# EAGLE design MOD-v2-4 (EAGLE 8.3.1)
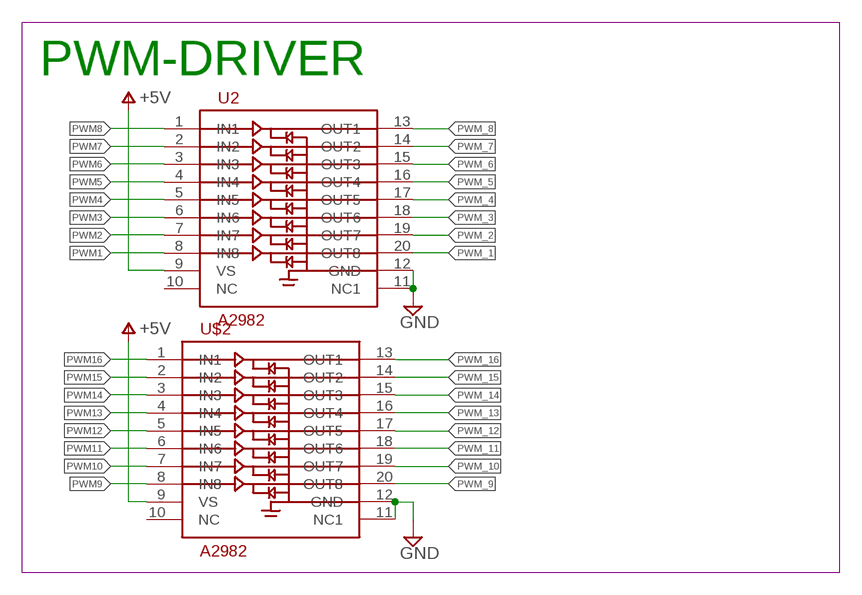
[diagram p0: schematic, sheet 1, part 1 of 2]
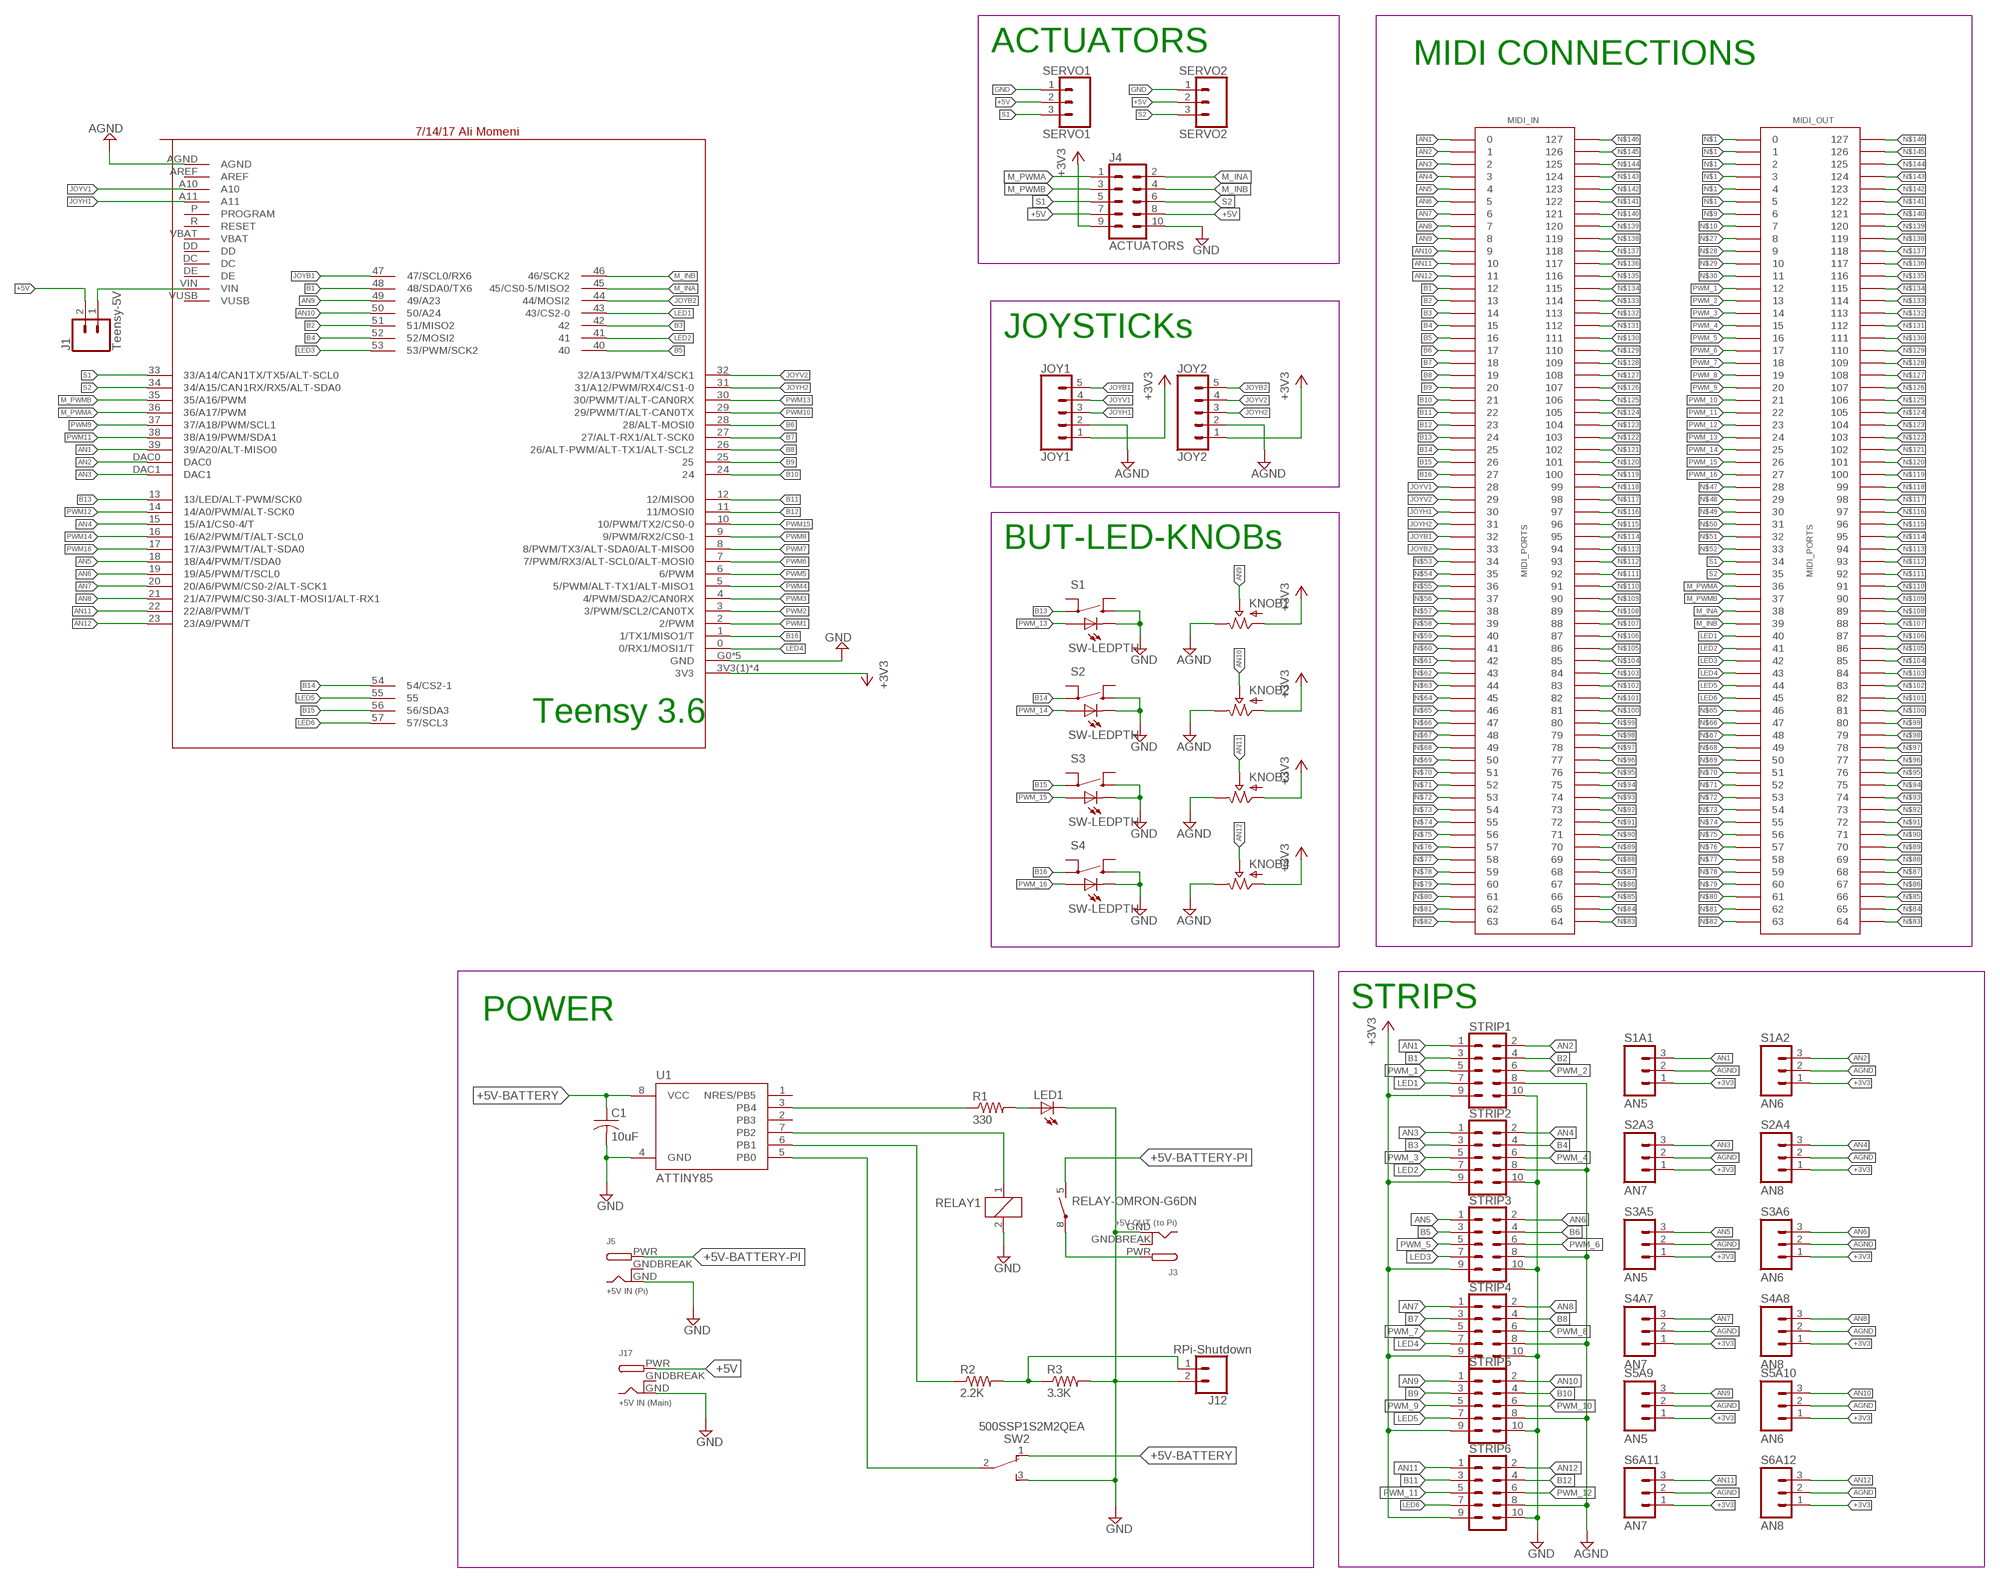
[diagram p1: schematic, sheet 1, part 2 of 2]

## Parts
C1  10uF  C-US050-024X044  [C050-024X044]
J1  Teensy-5V  CONN_02LOCK  [1X02_LOCK]
J3  +5V OUT (to Pi)  DCBARRELPTH  [DCJACK_2MM_PTH]
J4  ACTUATORS  CONN_05X2SHD_LOCK  [2X5-SHROUDED_LOCK]
J5  +5V IN (Pi)  DCBARRELPTH  [DCJACK_2MM_PTH]
J12  RPi-Shutdown  CONN_02LOCK  [1X02_LOCK]
J17  +5V IN (Main)  DCBARRELPTH  [DCJACK_2MM_PTH]
JOY1  JOY1  CONN_05LOCK  [1X05_LOCK]
JOY2  JOY2  CONN_05LOCK  [1X05_LOCK]
KNOB1  POTALPHA_RD901  [POT_ALPHA_RD901F-40-(L)R1]
KNOB2  POTALPHA_RD901  [POT_ALPHA_RD901F-40-(L)R1]
KNOB3  POTALPHA_RD901  [POT_ALPHA_RD901F-40-(L)R1]
KNOB4  POTALPHA_RD901  [POT_ALPHA_RD901F-40-(L)R1]
LED1  LED3MM  [LED3MM]
MIDI_IN  MIDI_PORTS  (no package)
MIDI_OUT  MIDI_PORTS  (no package)
R1  330  R-US_0204/7  [0204/7]
R2  2.2K  R-US_0204/7  [0204/7]
R3  3.3K  R-US_0204/7  [0204/7]
RELAY1  RELAY-OMRON-G6DN  [G6DN-1A]
S1  SW-LEDPTH  [SWITCH_TR2-MOMENTARY-LED]
S1A1  AN5  M03LOCK  [1X03_LOCK]
S1A2  AN6  M03LOCK  [1X03_LOCK]
S2  SW-LEDPTH  [SWITCH_TR2-MOMENTARY-LED]
S2A3  AN7  M03LOCK  [1X03_LOCK]
S2A4  AN8  M03LOCK  [1X03_LOCK]
S3  SW-LEDPTH  [SWITCH_TR2-MOMENTARY-LED]
S3A5  AN5  M03LOCK  [1X03_LOCK]
S3A6  AN6  M03LOCK  [1X03_LOCK]
S4  SW-LEDPTH  [SWITCH_TR2-MOMENTARY-LED]
S4A7  AN7  M03LOCK  [1X03_LOCK]
S4A8  AN8  M03LOCK  [1X03_LOCK]
S5A9  AN5  M03LOCK  [1X03_LOCK]
S5A10  AN6  M03LOCK  [1X03_LOCK]
S6A11  AN7  M03LOCK  [1X03_LOCK]
S6A12  AN8  M03LOCK  [1X03_LOCK]
SERVO1  SERVO1  CONN_03LOCK  [1X03_LOCK@1]
SERVO2  SERVO2  CONN_03LOCK  [1X03_LOCK@1]
STRIP1  CONN_05X2SHD_LOCK  [2X5-SHROUDED_LOCK]
STRIP2  CONN_05X2SHD_LOCK  [2X5-SHROUDED_LOCK]
STRIP3  CONN_05X2SHD_LOCK  [2X5-SHROUDED_LOCK]
STRIP4  CONN_05X2SHD_LOCK  [2X5-SHROUDED_LOCK]
STRIP5  CONN_05X2SHD_LOCK  [2X5-SHROUDED_LOCK]
STRIP6  CONN_05X2SHD_LOCK  [2X5-SHROUDED_LOCK]
SW2  500SSP1S2M2QEA  SWITCH_SPDT500SSP1S2M2QEA  [SWITCH_SPDT_500SSP1S2M2QEA]
TEENSY  TEENSY3_6-ALI_NO-USB-HOST  [TEENSY3-6_NO-USB-HOST]
U1  ATTINY85  [DIL08]
U2  A2982  [SOIC20]
U$2  A2982  [SOIC20]

## Nets
+3V3: J4.9 JOY1.1 JOY2.1 KNOB1.1(IN) KNOB2.1(IN) KNOB3.1(IN) KNOB4.1(IN) S1A1.1 S1A2.1 S2A3.1 S2A4.1 S3A5.1 S3A6.1 S4A7.1 S4A8.1 S5A9.1 S5A10.1 S6A11.1 S6A12.1 STRIP1.9 STRIP2.9 STRIP3.9 STRIP4.9 STRIP5.9 STRIP6.9 TEENSY.3V3(1)(3V3) TEENSY.3V3(2)(3V3) TEENSY.3V3(3)(3V3) TEENSY.3V3(4)(3V3)
+5V [Power Source]: J1.2 J4.7 J4.8 J17.PWR R1.1 SERVO1.2 SERVO2.2 U1.3(PB4) U2.9(VS) U$2.9(VS) ; supply symbol labelled V+
+5V-BATTERY [Power Source]: C1.1 SW2.1 U1.8(VCC)
+5V-BATTERY-PI [Power Source]: J5.PWR RELAY1.5
AGND [Analog Sig]: JOY1.2 JOY2.2 KNOB1.3(OUT) KNOB2.3(OUT) KNOB3.3(OUT) KNOB4.3(OUT) S1A1.2 S1A2.2 S2A3.2 S2A4.2 S3A5.2 S3A6.2 S4A7.2 S4A8.2 S5A9.2 S5A10.2 S6A11.2 S6A12.2 STRIP1.8 STRIP2.8 STRIP3.8 STRIP4.8 STRIP5.8 STRIP6.8 TEENSY.AGND
AN1 [Analog Sig]: MIDI_IN.0 S1A1.3 STRIP1.1 TEENSY.39(39/A20/ALT-MISO0)
AN2 [Analog Sig]: MIDI_IN.1 S1A2.3 STRIP1.2 TEENSY.DAC0
AN3 [Analog Sig]: MIDI_IN.2 S2A3.3 STRIP2.1 TEENSY.DAC1
AN4 [Analog Sig]: MIDI_IN.3 S2A4.3 STRIP2.2 TEENSY.15(15/A1/CS0-4/T)
AN5 [Analog Sig]: MIDI_IN.4 S3A5.3 STRIP3.1 TEENSY.18(18/A4/PWM/T/SDA0)
AN6 [Analog Sig]: MIDI_IN.5 S3A6.3 STRIP3.2 TEENSY.19(19/A5/PWM/T/SCL0)
AN7 [Analog Sig]: MIDI_IN.6 S4A7.3 STRIP4.1 TEENSY.20(20/A6/PWM/CS0-2/ALT-SCK1)
AN8 [Analog Sig]: MIDI_IN.7 S4A8.3 STRIP4.2 TEENSY.21(21/A7/PWM/CS0-3/ALT-MOSI1/ALT-RX1)
AN9 [Analog Sig]: KNOB1.2(WIPER) MIDI_IN.8 S5A9.3 STRIP5.1 TEENSY.49(49/A23)
AN10 [Analog Sig]: KNOB2.2(WIPER) MIDI_IN.9 S5A10.3 STRIP5.2 TEENSY.50(50/A24)
AN11 [Analog Sig]: KNOB3.2(WIPER) MIDI_IN.10 S6A11.3 STRIP6.1 TEENSY.22(22/A8/PWM/T)
AN12 [Analog Sig]: KNOB4.2(WIPER) MIDI_IN.11 S6A12.3 STRIP6.2 TEENSY.23(23/A9/PWM/T)
B1: MIDI_IN.12 STRIP1.3 TEENSY.48(48/SDA0/TX6)
B2: MIDI_IN.13 STRIP1.4 TEENSY.51(51/MISO2)
B3: MIDI_IN.14 STRIP2.3 TEENSY.42
B4: MIDI_IN.15 STRIP2.4 TEENSY.52(52/MOSI2)
B5: MIDI_IN.16 STRIP3.3 TEENSY.40
B6: MIDI_IN.17 STRIP3.4 TEENSY.28(28/ALT-MOSI0)
B7: MIDI_IN.18 STRIP4.3 TEENSY.27(27/ALT-RX1/ALT-SCK0)
B8: MIDI_IN.19 STRIP4.4 TEENSY.26(26/ALT-PWM/ALT-TX1/ALT-SCL2)
B9: MIDI_IN.20 STRIP5.3 TEENSY.25
B10: MIDI_IN.21 STRIP5.4 TEENSY.24
B11: MIDI_IN.22 STRIP6.3 TEENSY.12(12/MISO0)
B12: MIDI_IN.23 STRIP6.4 TEENSY.11(11/MOSI0)
B13: MIDI_IN.24 S1.3 TEENSY.13(13/LED/ALT-PWM/SCK0)
B14: MIDI_IN.25 S2.3 TEENSY.54(54/CS2-1)
B15: MIDI_IN.26 S3.3 TEENSY.56(56/SDA3)
B16: MIDI_IN.27 S4.3 TEENSY.1(1/TX1/MISO1/T)
GND [Power]: C1.2 J3.GND J4.10 J5.GND J12.2 J17.GND LED1.K(C) R3.2 RELAY1.2 S1.1 S1.C S2.1 S2.C S3.1 S3.C S4.1 S4.C SERVO1.1 SERVO2.1 STRIP1.10 STRIP2.10 STRIP3.10 STRIP4.10 STRIP5.10 STRIP6.10 SW2.3 TEENSY.G0(GND) TEENSY.G1(GND) TEENSY.G2(GND) TEENSY.G3(GND) TEENSY.G6(GND) U1.4(GND) U2.11(NC1) U2.12(GND) U$2.11(NC1) U$2.12(GND)
JOYB1: JOY1.5 MIDI_IN.32 TEENSY.47(47/SCL0/RX6)
JOYB2: JOY2.5 MIDI_IN.33 TEENSY.44(44/MOSI2)
JOYH1 [Analog Sig]: JOY1.3 MIDI_IN.30 TEENSY.A11
JOYH2 [Analog Sig]: JOY2.3 MIDI_IN.31 TEENSY.31(31/A12/PWM/RX4/CS1-0)
JOYV1 [Analog Sig]: JOY1.4 MIDI_IN.28 TEENSY.A10
JOYV2 [Analog Sig]: JOY2.4 MIDI_IN.29 TEENSY.32(32/A13/PWM/TX4/SCK1)
LED1: MIDI_OUT.40 STRIP1.7 TEENSY.43(43/CS2-0)
LED2: MIDI_OUT.41 STRIP2.7 TEENSY.41
LED3: MIDI_OUT.42 STRIP3.7 TEENSY.53(53/PWM/SCK2)
LED4: MIDI_OUT.43 STRIP4.7 TEENSY.0(0/RX1/MOSI1/T)
LED5: MIDI_OUT.44 STRIP5.7 TEENSY.55
LED6: MIDI_OUT.45 STRIP6.7 TEENSY.57(57/SCL3)
M_INA: J4.2 MIDI_OUT.38 TEENSY.45(45/CS0-5/MISO2)
M_INB: J4.4 MIDI_OUT.39 TEENSY.46(46/SCK2)
M_PWMA: J4.1 MIDI_OUT.36 TEENSY.36(36/A17/PWM)
M_PWMB: J4.3 MIDI_OUT.37 TEENSY.35(35/A16/PWM)
N$1: MIDI_OUT.0 MIDI_OUT.1 MIDI_OUT.2 MIDI_OUT.3 MIDI_OUT.4 MIDI_OUT.5
N$2: LED1.A R1.2
N$3: SW2.2 U1.5(PB0)
N$4: RELAY1.1 U1.7(PB2)
N$5: J12.1 R2.2 R3.1
N$6 [Power Source]: J3.PWR RELAY1.8
N$7: J1.1 TEENSY.VIN
N$9: MIDI_OUT.6
N$10: MIDI_OUT.7
N$27: MIDI_OUT.8
N$28: MIDI_OUT.9
N$29: MIDI_OUT.10
N$30: MIDI_OUT.11
N$47: MIDI_OUT.28
N$48: MIDI_OUT.29
N$49: MIDI_OUT.30
N$50: MIDI_OUT.31
N$51: MIDI_OUT.32
N$52: MIDI_OUT.33
N$53: MIDI_IN.34
N$54: MIDI_IN.35
N$55: MIDI_IN.36
N$56: MIDI_IN.37
N$57: MIDI_IN.38
N$58: MIDI_IN.39
N$59: MIDI_IN.40
N$60: MIDI_IN.41
N$61: MIDI_IN.42
N$62: MIDI_IN.43
N$63: MIDI_IN.44
N$64: MIDI_IN.45
N$65: MIDI_IN.46 MIDI_OUT.46
N$66: MIDI_IN.47 MIDI_OUT.47
N$67: MIDI_IN.48 MIDI_OUT.48
N$68: MIDI_IN.49 MIDI_OUT.49
N$69: MIDI_IN.50 MIDI_OUT.50
N$70: MIDI_IN.51 MIDI_OUT.51
N$71: MIDI_IN.52 MIDI_OUT.52
N$72: MIDI_IN.53 MIDI_OUT.53
N$73: MIDI_IN.54 MIDI_OUT.54
N$74: MIDI_IN.55 MIDI_OUT.55
N$75: MIDI_IN.56 MIDI_OUT.56
N$76: MIDI_IN.57 MIDI_OUT.57
N$77: MIDI_IN.58 MIDI_OUT.58
N$78: MIDI_IN.59 MIDI_OUT.59
N$79: MIDI_IN.60 MIDI_OUT.60
N$80: MIDI_IN.61 MIDI_OUT.61
N$81: MIDI_IN.62 MIDI_OUT.62
N$82: MIDI_IN.63 MIDI_OUT.63
N$83: MIDI_IN.64 MIDI_OUT.64
N$84: MIDI_IN.65 MIDI_OUT.65
N$85: MIDI_IN.66 MIDI_OUT.66
N$86: MIDI_IN.67 MIDI_OUT.67
N$87: MIDI_IN.68 MIDI_OUT.68
N$88: MIDI_IN.69 MIDI_OUT.69
N$89: MIDI_IN.70 MIDI_OUT.70
N$90: MIDI_IN.71 MIDI_OUT.71
N$91: MIDI_IN.72 MIDI_OUT.72
N$92: MIDI_IN.73 MIDI_OUT.73
N$93: MIDI_IN.74 MIDI_OUT.74
N$94: MIDI_IN.75 MIDI_OUT.75
N$95: MIDI_IN.76 MIDI_OUT.76
N$96: MIDI_IN.77 MIDI_OUT.77
N$97: MIDI_IN.78 MIDI_OUT.78
N$98: MIDI_IN.79 MIDI_OUT.79
N$99: MIDI_IN.80 MIDI_OUT.80
N$100: MIDI_IN.81 MIDI_OUT.81
N$101: MIDI_IN.82 MIDI_OUT.82
N$102: MIDI_IN.83 MIDI_OUT.83
N$103: MIDI_IN.84 MIDI_OUT.84
N$104: MIDI_IN.85 MIDI_OUT.85
N$105: MIDI_IN.86 MIDI_OUT.86
N$106: MIDI_IN.87 MIDI_OUT.87
N$107: MIDI_IN.88 MIDI_OUT.88
N$108: MIDI_IN.89 MIDI_OUT.89
N$109: MIDI_IN.90 MIDI_OUT.90
N$110: MIDI_IN.91 MIDI_OUT.91
N$111: MIDI_IN.92 MIDI_OUT.92
N$112: MIDI_IN.93 MIDI_OUT.93
N$113: MIDI_IN.94 MIDI_OUT.94
N$114: MIDI_IN.95 MIDI_OUT.95
N$115: MIDI_IN.96 MIDI_OUT.96
N$116: MIDI_IN.97 MIDI_OUT.97
N$117: MIDI_IN.98 MIDI_OUT.98
N$118: MIDI_IN.99 MIDI_OUT.99
N$119: MIDI_IN.100 MIDI_OUT.100
N$120: MIDI_IN.101 MIDI_OUT.101
N$121: MIDI_IN.102 MIDI_OUT.102
N$122: MIDI_IN.103 MIDI_OUT.103
N$123: MIDI_IN.104 MIDI_OUT.104
N$124: MIDI_IN.105 MIDI_OUT.105
N$125: MIDI_IN.106 MIDI_OUT.106
N$126: MIDI_IN.107 MIDI_OUT.107
N$127: MIDI_IN.108 MIDI_OUT.108
N$128: MIDI_IN.109 MIDI_OUT.109
N$129: MIDI_IN.110 MIDI_OUT.110
N$130: MIDI_IN.111 MIDI_OUT.111
N$131: MIDI_IN.112 MIDI_OUT.112
N$132: MIDI_IN.113 MIDI_OUT.113
N$133: MIDI_IN.114 MIDI_OUT.114
N$134: MIDI_IN.115 MIDI_OUT.115
N$135: MIDI_IN.116 MIDI_OUT.116
N$136: MIDI_IN.117 MIDI_OUT.117
N$137: MIDI_IN.118 MIDI_OUT.118
N$138: MIDI_IN.119 MIDI_OUT.119
N$139: MIDI_IN.120 MIDI_OUT.120
N$140: MIDI_IN.121 MIDI_OUT.121
N$141: MIDI_IN.122 MIDI_OUT.122
N$142: MIDI_IN.123 MIDI_OUT.123
N$143: MIDI_IN.124 MIDI_OUT.124
N$144: MIDI_IN.125 MIDI_OUT.125
N$145: MIDI_IN.126 MIDI_OUT.126
N$146: MIDI_IN.127 MIDI_OUT.127
PI-REST: R2.1 U1.6(PB1)
PWM1: TEENSY.2(2/PWM) U2.8(IN8)
PWM2: TEENSY.3(3/PWM/SCL2/CAN0TX) U2.7(IN7)
PWM3: TEENSY.4(4/PWM/SDA2/CAN0RX) U2.6(IN6)
PWM4: TEENSY.5(5/PWM/ALT-TX1/ALT-MISO1) U2.5(IN5)
PWM5: TEENSY.6(6/PWM) U2.4(IN4)
PWM6: TEENSY.7(7/PWM/RX3/ALT-SCL0/ALT-MOSI0) U2.3(IN3)
PWM7: TEENSY.8(8/PWM/TX3/ALT-SDA0/ALT-MISO0) U2.2(IN2)
PWM8: TEENSY.9(9/PWM/RX2/CS0-1) U2.1(IN1)
PWM9: TEENSY.37(37/A18/PWM/SCL1) U$2.8(IN8)
PWM10: TEENSY.29(29/PWM/T/ALT-CAN0TX) U$2.7(IN7)
PWM11: TEENSY.38(38/A19/PWM/SDA1) U$2.6(IN6)
PWM12: TEENSY.14(14/A0/PWM/ALT-SCK0) U$2.5(IN5)
PWM13: TEENSY.30(30/PWM/T/ALT-CAN0RX) U$2.4(IN4)
PWM14: TEENSY.16(16/A2/PWM/T/ALT-SCL0) U$2.3(IN3)
PWM15: TEENSY.10(10/PWM/TX2/CS0-0) U$2.2(IN2)
PWM16: TEENSY.17(17/A3/PWM/T/ALT-SDA0) U$2.1(IN1)
PWM_1 [Power]: MIDI_OUT.12 STRIP1.5 U2.20(OUT8)
PWM_2 [Power]: MIDI_OUT.13 STRIP1.6 U2.19(OUT7)
PWM_3 [Power]: MIDI_OUT.14 STRIP2.5 U2.18(OUT6)
PWM_4 [Power]: MIDI_OUT.15 STRIP2.6 U2.17(OUT5)
PWM_5 [Power]: MIDI_OUT.16 STRIP3.5 U2.16(OUT4)
PWM_6 [Power]: MIDI_OUT.17 STRIP3.6 U2.15(OUT3)
PWM_7 [Power]: MIDI_OUT.18 STRIP4.5 U2.14(OUT2)
PWM_8 [Power]: MIDI_OUT.19 STRIP4.6 U2.13(OUT1)
PWM_9 [Power]: MIDI_OUT.20 STRIP5.5 U$2.20(OUT8)
PWM_10 [Power]: MIDI_OUT.21 STRIP5.6 U$2.19(OUT7)
PWM_11 [Power]: MIDI_OUT.22 STRIP6.5 U$2.18(OUT6)
PWM_12 [Power]: MIDI_OUT.23 STRIP6.6 U$2.17(OUT5)
PWM_13 [Power]: MIDI_OUT.24 S1.A U$2.16(OUT4)
PWM_14 [Power]: MIDI_OUT.25 S2.A U$2.15(OUT3)
PWM_15 [Power]: MIDI_OUT.26 S3.A U$2.14(OUT2)
PWM_16 [Power]: MIDI_OUT.27 S4.A U$2.13(OUT1)
S1: J4.5 MIDI_OUT.34 SERVO1.3 TEENSY.33(33/A14/CAN1TX/TX5/ALT-SCL0)
S2: J4.6 MIDI_OUT.35 SERVO2.3 TEENSY.34(34/A15/CAN1RX/RX5/ALT-SDA0)
Unconnected: S1.2 S1.4 S2.2 S2.4 S3.2 S3.4 S4.2 S4.4 TEENSY.AREF TEENSY.DC TEENSY.DD TEENSY.DE TEENSY.P(PROGRAM) TEENSY.R(RESET) TEENSY.VBAT TEENSY.VUSB U1.1(NRES/PB5) U1.2(PB3) U2.10(NC) U$2.10(NC)

## Notes on the sheet
- ACTUATORS
- MIDI CONNECTIONS
- JOYSTICKs
- BUT-LED-KNOBs
- Teensy 3.6
- PWM-DRIVER
- STRIPS
- POWER

## Power pins joined to a net without a drawn wire
GNDBREAK: J3.GNDBREAK J5.GNDBREAK J17.GNDBREAK

## Library data of the parts
C1 = resistor:C-US: CAPACITOR, American symbol
J1 J12 = SparkFun-Connectors:CONN_02: Multi connection point. Often used as Generic Header-pin footprint for 0.1 inch spaced/style header connections On any of the 0.1 inch spaced packages, you can populate with these: Break Away Headers - Straight <https://www.sparkfun.com/products/116> (PRT-00116) Break Away Male Headers - Right Angle <https://www.sparkfun.com/products/553> (PRT-00553) Female Headers <https://www.sparkfun.com/products/115> (PRT-00115) Break Away Headers - Machine Pin <https://www.sparkfun.com/products/117> (PRT-00117) Break Away Female Headers - Swiss Machine Pin <https://www.sparkfun.com/products/743> (PRT-00743) For SCREWTERMINALS and SPRING TERMINALS visit here: Screw Terimnals on SparkFun.com <https://www.sparkfun.com/search/results?term=Screw+Terminals> (5mm/3.5mm/2.54mm spacing) This device is also useful as a general connection point to wire up your design to another part of your project. Our various solder wires solder well into these plated through hole pads. Hook-Up Wire - Assortment (Stranded, 22 AWG) <https://www.sparkfun.com/products/11375> (PRT-11375) Hook-Up Wire - Assortment (Solid Core, 22 AWG) <https://www.sparkfun.com/products/11367> (PRT-11367) View the entire wire category on our website here <https://www.sparkfun.com/categories/141> Special notes: Molex polarized connector foot print use with: PRT-08233 with associated crimp pins and housings. 2.54_SCREWTERM for use with PRT-10571. 3.5mm Screw Terminal footprints for PRT-08084 5mm Screw Terminal footprints for use with PRT-08432
J3 J5 J17 = adafruit:DCBARREL: 2.0mm DC Barrel Jack DCJACK_2MM_PTH - Through Hole Jack (4UConnector: 05537)
J4 STRIP1-STRIP6 = SparkFun-Connectors:CONN_05X2: Multi connection point. Often used as Generic Header-pin footprint for 0.1 inch spaced/style header connections For AVR SPI programming port, see special device with nice symbol: "AVR_SPI_PROG_5x2.dev" You can populate with any combo of single row headers, but if you'd like an exact match, check these: 2x5 AVR ICSP Male Header <https://www.sparkfun.com/products/778> (PRT-00778) 2x5 Pin Shrouded Header <https://www.sparkfun.com/products/8506> (PRT-08506) On any of the 0.1 inch spaced packages, you can populate with these: Break Away Headers - Straight <https://www.sparkfun.com/products/116> (PRT-00116) Break Away Male Headers - Right Angle <https://www.sparkfun.com/products/553> (PRT-00553) Female Headers <https://www.sparkfun.com/products/115> (PRT-00115) Break Away Headers - Machine Pin <https://www.sparkfun.com/products/117> (PRT-00117) Break Away Female Headers - Swiss Machine Pin <https://www.sparkfun.com/products/743> (PRT-00743) Special note: the shrouded connector mates well with our 5x2 ribbon cables: 2x5 Pin IDC Ribbon Cable <https://www.sparkfun.com/products/8535> (PRT-08535); PROD_ID: CONN-08671; SF_ID: PRT-08506
JOY1 JOY2 = SparkFun-Connectors:CONN_05: Multi connection point. Often used as Generic Header-pin footprint for 0.1 inch spaced/style header connections On any of the 0.1 inch spaced packages, you can populate with these: Break Away Headers - Straight <https://www.sparkfun.com/products/116> (PRT-00116) Break Away Male Headers - Right Angle <https://www.sparkfun.com/products/553> (PRT-00553) Female Headers <https://www.sparkfun.com/products/115> (PRT-00115) Break Away Headers - Machine Pin <https://www.sparkfun.com/products/117> (PRT-00117) Break Away Female Headers - Swiss Machine Pin <https://www.sparkfun.com/products/743> (PRT-00743) For SCREWTERMINALS and SPRING TERMINALS visit here: Screw Terimnals on SparkFun.com <https://www.sparkfun.com/search/results?term=Screw+Terminals> (5mm/3.5mm/2.54mm spacing) This device is also useful as a general connection point to wire up your design to another part of your project. Our various solder wires solder well into these plated through hole pads. Hook-Up Wire - Assortment (Stranded, 22 AWG) <https://www.sparkfun.com/products/11375> (PRT-11375) Hook-Up Wire - Assortment (Solid Core, 22 AWG) <https://www.sparkfun.com/products/11367> (PRT-11367) View the entire wire category on our website here <https://www.sparkfun.com/categories/141> Special notes: Molex polarized connector foot print use with SKU : PRT-08231 with associated crimp pins and housings. 1MM SMD Version SKU: PRT-10208
KNOB1-KNOB4 = CMU-ArtFab:POT: http://www.taydaelectronics.com/10k-ohm-linear-taper-potentiometer-round-shaft-pcb-9mm.html http://www.taydaelectronics.com/datasheets/A-1847.pdf
LED1 = led:LED: LED OSRAM: - CHIPLED LG R971, LG N971, LY N971, LG Q971, LY Q971, LO R971, LY R971 LH N974, LH R974 LS Q976, LO Q976, LY Q976 LO Q996 - Hyper CHIPLED LW Q18S LB Q993, LB Q99A, LB R99A - SideLED LS A670, LO A670, LY A670, LG A670, LP A670 LB A673, LV A673, LT A673, LW A673 LH A674 LY A675 LS A676, LA A676, LO A676, LY A676, LW A676 LS A679, LY A679, LG A679 - Hyper Micro SIDELED® LS Y876, LA Y876, LO Y876, LY Y876 LT Y87S - SmartLED LW L88C, LW L88S LB L89C, LB L89S, LG L890 LS L89K, LO L89K, LY L89K LS L896, LA L896, LO L896, LY L896 - TOPLED LS T670, LO T670, LY T670, LG T670, LP T670 LSG T670, LSP T670, LSY T670, LOP T670, LYG T670 LG T671, LOG T671, LSG T671 LB T673, LV T673, LT T673, LW T673 LH T674 LS T676, LA T676, LO T676, LY T676, LB T676, LH T676, LSB T676, LW T676 LB T67C, LV T67C, LT T67C, LS T67K, LO T67K, LY T67K, LW E67C LS E67B, LA E67B, LO E67B, LY E67B, LB E67C, LV E67C, LT E67C LW T67C LS T679, LY T679, LG T679 LS T770, LO T770, LY T770, LG T770, LP T770 LB T773, LV T773, LT T773, LW T773 LH T774 LS E675, LA E675, LY E675, LS T675 LS T776, LA T776, LO T776, LY T776, LB T776 LHGB T686 LT T68C, LB T68C - Hyper Mini TOPLED® LB M676 - Mini TOPLED Santana® LG M470 LS M47K, LO M47K, LY M47K Source: http://www.osram.convergy.de LUXEON: - LUMILED® LXK2-PW12-R00, LXK2-PW12-S00, LXK2-PW14-U00, LXK2-PW14-V00 LXK2-PM12-R00, LXK2-PM12-S00, LXK2-PM14-U00 LXK2-PE12-Q00, LXK2-PE12-R00, LXK2-PE12-S00, LXK2-PE14-T00, LXK2-PE14-U00 LXK2-PB12-K00, LXK2-PB12-L00, LXK2-PB12-M00, LXK2-PB14-N00, LXK2-PB14-P00, LXK2-PB14-Q00 LXK2-PR12-L00, LXK2-PR12-M00, LXK2-PR14-Q00, LXK2-PR14-R00 LXK2-PD12-Q00, LXK2-PD12-R00, LXK2-PD12-S00 LXK2-PH12-R00, LXK2-PH12-S00 LXK2-PL12-P00, LXK2-PL12-Q00, LXK2-PL12-R00 Source: www.luxeon.com KINGBRIGHT: KA-3528ASYC Source: www.kingbright.com
MIDI_IN MIDI_OUT = CMU-ArtFab:MIDI_PORTS
R1-R3 = rcl:R-US_: RESISTOR, American symbol
RELAY1 = CMU-ArtFab:RELAY-OMRON-G6DN
S1-S4 = CMU-ArtFab:SW-LED: SWITCH PUSH SPST-NO 10MA 12V
S1A1 S1A2 S2A3 S2A4 S3A5 S3A6 S4A7 S4A8 S5A9 S5A10 S6A11 S6A12 = SparkFun-Connectors:M03: Header 3 Standard 3-pin 0.1" header. Use with straight break away headers (SKU : PRT-00116), right angle break away headers (PRT-00553), swiss pins (PRT-00743), machine pins (PRT-00117), and female headers (PRT-00115). Molex polarized connector foot print use with SKU : PRT-08232 with associated crimp pins and housings.
SERVO1 SERVO2 = SparkFun-Connectors:CONN_03: Multi connection point. Often used as Generic Header-pin footprint for 0.1 inch spaced/style header connections On any of the 0.1 inch spaced packages, you can populate with these: Break Away Headers - Straight <https://www.sparkfun.com/products/116> (PRT-00116) Break Away Male Headers - Right Angle <https://www.sparkfun.com/products/553> (PRT-00553) Female Headers <https://www.sparkfun.com/products/115> (PRT-00115) Break Away Headers - Machine Pin <https://www.sparkfun.com/products/117> (PRT-00117) Break Away Female Headers - Swiss Machine Pin <https://www.sparkfun.com/products/743> (PRT-00743) Stackable Header - 3 Pin (Female, 0.1") <https://www.sparkfun.com/products/13875> (PRT-13875) For SCREWTERMINALS and SPRING TERMINALS visit here: Screw Terimnals on SparkFun.com <https://www.sparkfun.com/search/results?term=Screw+Terminals> (5mm/3.5mm/2.54mm spacing) This device is also useful as a general connection point to wire up your design to another part of your project. Our various solder wires solder well into these plated through hole pads. Hook-Up Wire - Assortment (Stranded, 22 AWG) <https://www.sparkfun.com/products/11375> (PRT-11375) Hook-Up Wire - Assortment (Solid Core, 22 AWG) <https://www.sparkfun.com/products/11367> (PRT-11367) View the entire wire category on our website here <https://www.sparkfun.com/categories/141> Special notes: Molex polarized connector foot print use with SKU : PRT-08232 with associated crimp pins and housings.
SW2 = CMU-ArtFab:SWITCH_SPDT; DIGIKEY: EG5137-ND
TEENSY = CMU-ArtFab:TEENSY3_6-ALI_NO-USB-HOST
U1 = CMU-ArtFab:ATTINY85: ATMEL ATtiny 85
U2 U$2 = CMU-ArtFab:A2982

## Net classes
2 Power: width 0.61 mm, clearance 0.305 mm
3 Analog Sig: width 0.406 mm, clearance 0.305 mm
4 Power Source: width 1.27 mm, clearance 0.305 mm

## Board
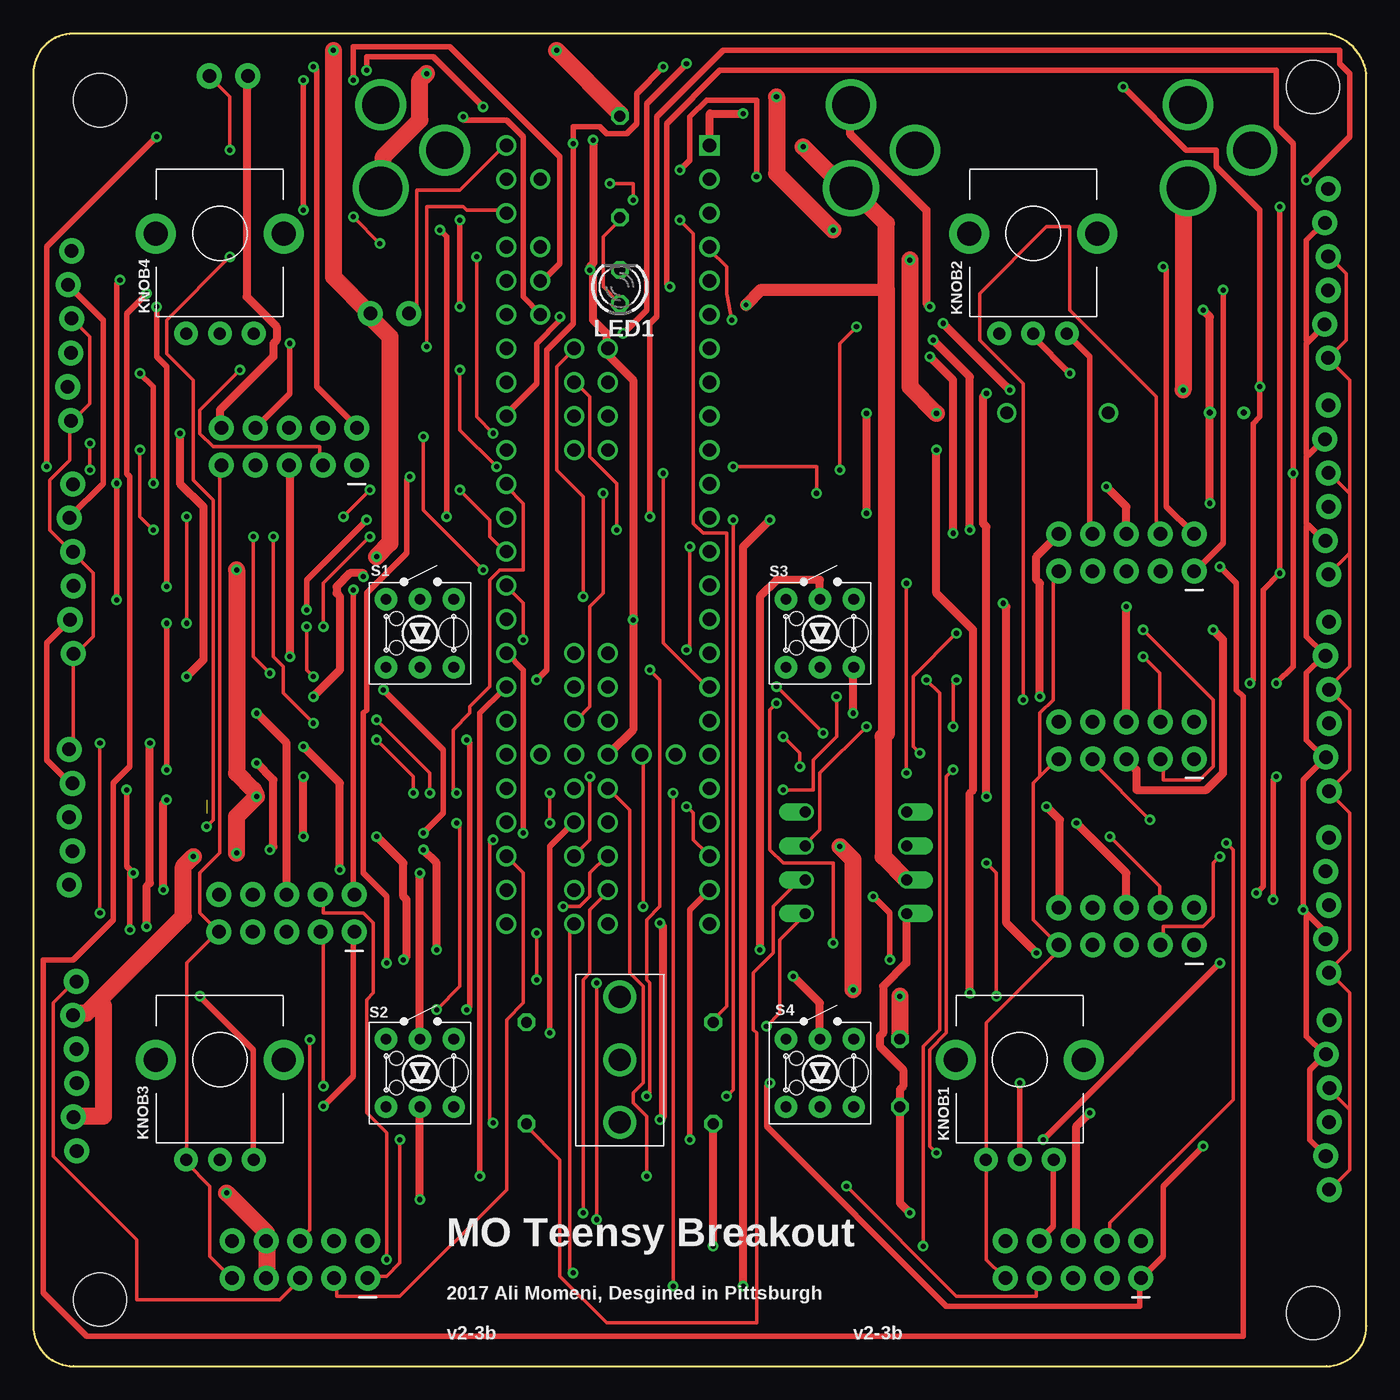
[diagram p2: board, top side]
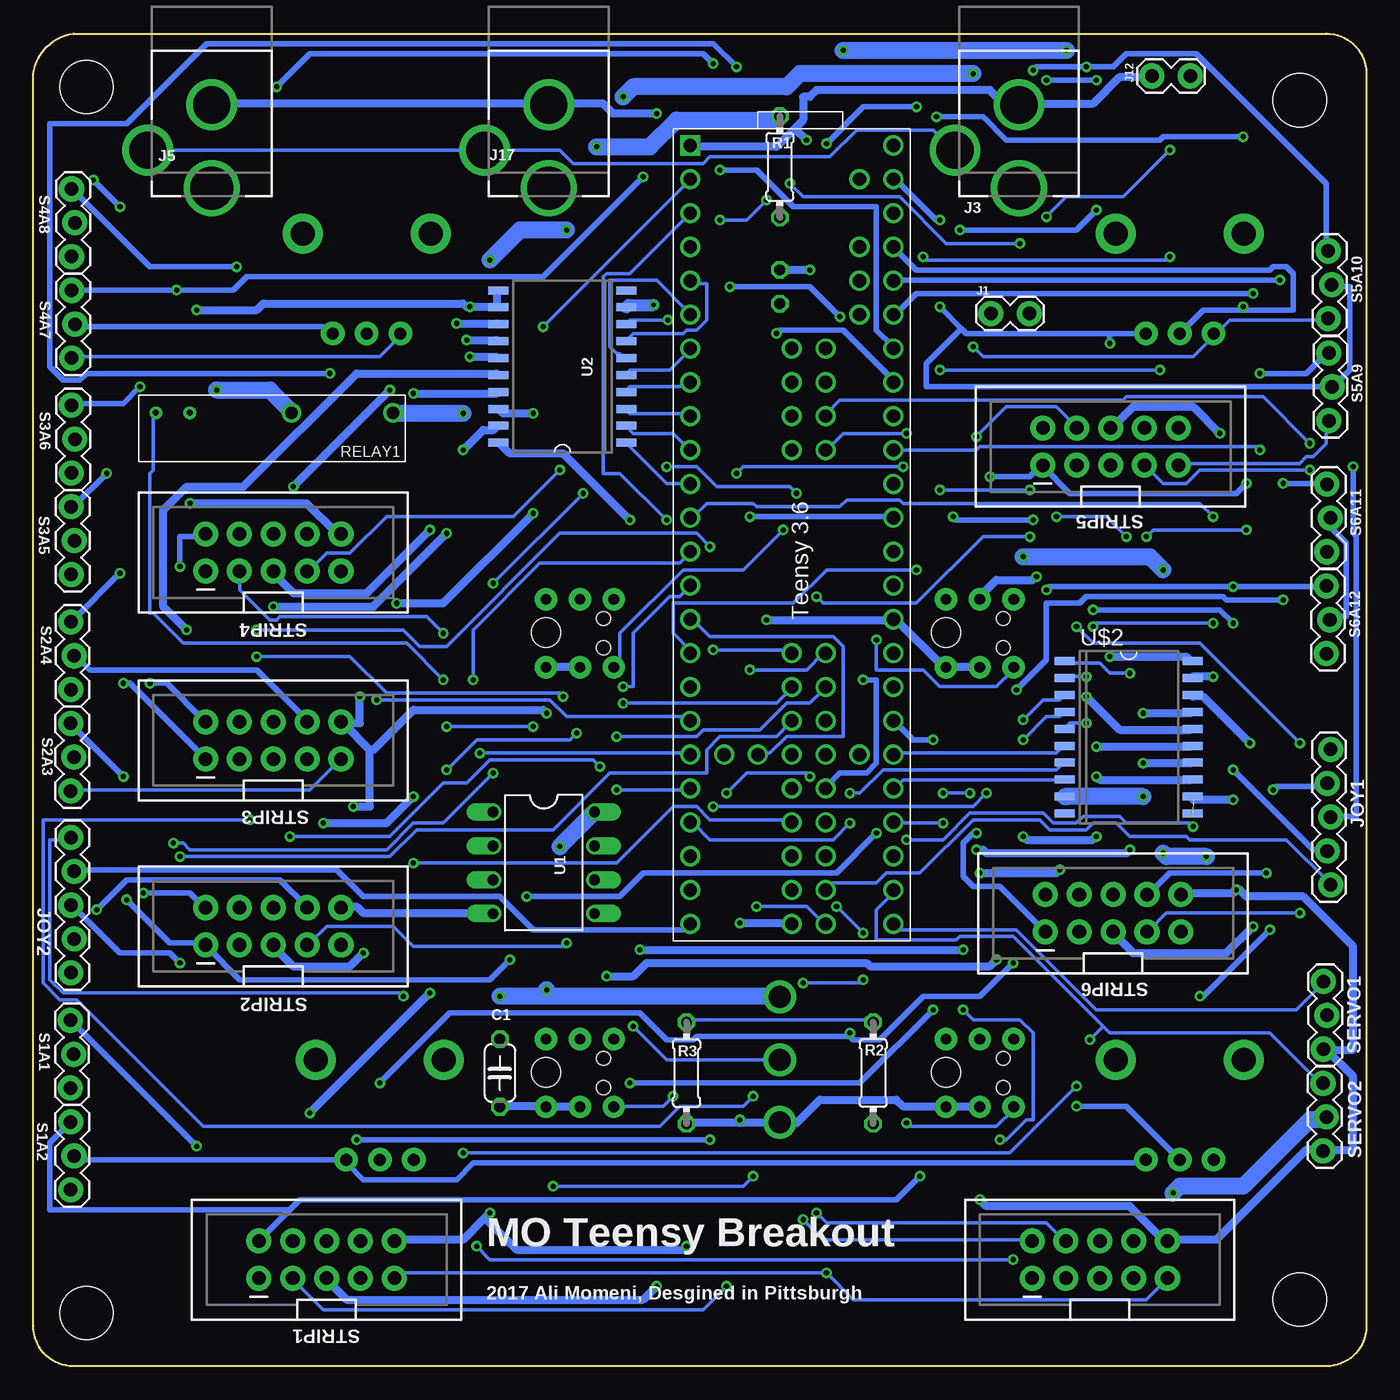
[diagram p3: board, bottom side, seen from below]

Size 100 x 100 mm. Coordinates in mm from the lower left corner, seen from the top.
Outline: 3,100 arc90 0,97 0,3 arc90 3,0 97,0 arc90 100,3 100,97 arc74 97,100 3,100
Copper layers (1*16): Top 0.035559375mm / dielectric 1.501140625mm / Bottom 0.035559375mm
Design rules "typical_4pcb *": minimum track width 10mil, minimum drill 15mil, track to track 6mil, track to pad 10mil, pad to pad 10mil, via to via 10mil, smd to smd 10mil, copper to edge 15mil, drill to drill 8mil, minimum pad ring 10mil, minimum via ring 8mil, stop-mask expansion 4mil, vias tented up to drill 0mil, thermal gap 10mil
Holes 4 mm at 5,5 96,4 96,96 5,95

### Footprints (pad centres in the part's own frame; a part is rotated, then mirrored left to right if it is on the bottom)
C050-024X044 = drill 0.813 octagon: 1 -2.54,0; 2 2.54,0
1X02_LOCK = drill 1.016 pad 1.88: 1 -0.178,0; 2 2.718,0
DCJACK_2MM_PTH = drill 2.8: GND 0,7.35; GNDBREAK 4.8,10.75 | drill 3.2: PWR 0,13.6
2X5-SHROUDED_LOCK = drill 1.016 pad 1.88: 1 -1.397,5.08; 2 1.397,5.08; 3 -1.397,2.54; 4 1.397,2.54; 5 -1.397,0; 6 1.397,0; 7 -1.397,-2.54; 8 1.397,-2.54; 9 -1.397,-5.08; 10 1.397,-5.08
1X05_LOCK = drill 1.016 pad 1.88: 1 0,0.127; 2 2.54,-0.127; 3 5.08,0.127; 4 7.62,-0.127; 5 10.16,0.127
POT_ALPHA_RD901F-40-(L)R1 = drill 0.9 pad 1.778: 1 -2.54,-7.5; 2 0,-7.5; 3 2.54,-7.5 | drill 1.8 pad 3: M1 -4.8,0; M2 4.8,0
LED3MM = drill 0.813 octagon: A -1.27,0; K 1.27,0
0204/7 = drill 0.813 octagon: 1 -3.81,0; 2 3.81,0
G6DN-1A = drill 0.45: 1 0,0; 2 2.54,0 | drill 0.95: 5 10.16,0; 8 17.78,0
SWITCH_TR2-MOMENTARY-LED = drill 0.8 pad 1.676: 1 2.54,-2.54; 2 2.54,2.54; 3 -2.54,-2.54; 4 -2.54,2.54; A 0,2.54; C 0,-2.54 | hole 2.2: 2.53,0.05 | hole 1.05: -1.76,1.1; -1.76,-1.09
1X03_LOCK = drill 1.016 pad 1.88: 1 0,0.127; 2 2.54,-0.127; 3 5.08,0.127
1X03_LOCK@1 = drill 1.016 pad 1.88: 1 0,0.127; 2 2.54,-0.127; 3 5.08,0.127
SWITCH_SPDT_500SSP1S2M2QEA = drill 1.65: 1 -4.7,0; 2 0,0; 3 4.7,0
TEENSY3-6_NO-USB-HOST = drill 1: 0 3.81,1.27; 1 6.35,1.27; 2 8.89,1.27; 3 11.43,1.27; 3V3(1) 36.83,1.27; 3V3(2) 46.99,6.35; 3V3(3) 6.35,16.51; 3V3(4) 59.69,11.43; 4 13.97,1.27; 5 16.51,1.27; 6 19.05,1.27; 7 21.59,1.27; 8 24.13,1.27; 9 26.67,1.27; 10 29.21,1.27; 11 31.75,1.27; 12 34.29,1.27; 13 34.29,16.51; 14 31.75,16.51; 15 29.21,16.51; 16 26.67,16.51; 17 24.13,16.51; 18 21.59,16.51; 19 19.05,16.51; 20 16.51,16.51; 21 13.97,16.51; 22 11.43,16.51; 23 8.89,16.51; 24 39.37,1.27; 25 41.91,1.27; 26 44.45,1.27; 27 46.99,1.27; 28 49.53,1.27; 29 52.07,1.27; 30 54.61,1.27; 31 57.15,1.27; 32 59.69,1.27; 33 59.69,16.51; 34 57.15,16.51; 35 54.61,16.51; 36 52.07,16.51; 37 49.53,16.51; 38 46.99,16.51; 39 44.45,16.51; 40 39.37,8.89; 41 41.91,8.89; 42 44.45,8.89; 43 49.53,8.89; 44 52.07,8.89; 45 54.61,8.89; 46 57.15,8.89; 47 57.15,11.43; 48 54.61,11.43; 49 52.07,11.43; 50 49.53,11.43; 51 44.45,11.43; 52 41.91,11.43; 53 39.37,11.43; 54 24.13,11.43; 55 21.59,11.43; 56 19.05,11.43; 57 16.51,11.43; A10 11.43,13.97; A11 13.97,13.97; AGND 3.81,16.51; AREF 8.89,13.97; DAC0 41.91,16.51; DAC1 39.37,16.51; DC 21.59,8.89; DD 24.13,8.89; DE 19.05,8.89; G1 46.99,8.89; G2 36.83,16.51; G3 59.69,8.89; G6 16.51,8.89; P 46.99,11.43; R 46.99,13.97; VBAT 46.99,3.81; VIN 1.27,16.51; VUSB 3.81,13.97 | drill 1 square: G0 1.27,1.27
DIL08 = drill 0.813 offset: 1 -3.81,-3.81; 2 -1.27,-3.81; 3 1.27,-3.81; 4 3.81,-3.81; 5 3.81,3.81; 6 1.27,3.81; 7 -1.27,3.81; 8 -3.81,3.81
SOIC20 = smd 0.6 x 1.5: 1 -5.715,-4.8; 2 -4.445,-4.8; 3 -3.175,-4.8; 4 -1.905,-4.8; 5 -0.635,-4.8; 6 0.635,-4.8; 7 1.905,-4.8; 8 3.175,-4.8; 9 4.445,-4.8; 10 5.715,-4.8; 11 5.715,4.8; 12 4.445,4.8; 13 3.175,4.8; 14 1.905,4.8; 15 0.635,4.8; 16 -0.635,4.8; 17 -1.905,4.8; 18 -3.175,4.8; 19 -4.445,4.8; 20 -5.715,4.8

### Placement (x,y rotation side)
C1  65,22 270 bottom
J1  28,79 0 bottom
J3  26.06,102 180 bottom
J4  20,8 90 bottom
J5  86.61,102 180 bottom
J12  13.38,96.82 180 bottom
J17  61.34,102 180 bottom
JOY1  2.81,46.28 270 bottom
JOY2  97.06,29.52 90 bottom
KNOB1  74,23 0 top
KNOB2  75,85 0 top
KNOB3  14,23 0 top
KNOB4  14,85 0 top
LED1  44,81 90 top
R1  44,90 270 bottom
R2  37,22 90 bottom
R3  51,22 270 bottom
RELAY1  90.8,71.54 0 bottom
S1  29,55 0 top
S1A1  97.1,20.88 90 bottom
S1A2  97.08,13.24 90 bottom
S2  29,22 0 top
S2A3  97.08,43.16 90 bottom
S2A4  97.06,50.77 90 bottom
S3  59,55 0 top
S3A5  97.04,59.41 90 bottom
S3A6  97.02,67.03 90 bottom
S4  59,22 0 top
S4A7  97,75.65 90 bottom
S4A8  97.01,83.26 90 bottom
S5A9  2.69,70.95 90 bottom
S5A10  2.74,78.61 90 bottom
S6A11  2.83,61.11 90 bottom
S6A12  2.88,53.47 90 bottom
SERVO1  3.1,23.79 90 bottom
SERVO2  3.13,16.16 90 bottom
STRIP1  78,8 90 bottom
STRIP2  82,33.01 90 bottom
STRIP3  82,46.96 90 bottom
STRIP4  82,61.05 90 bottom
STRIP5  19.19,69 90 bottom
STRIP6  19,33.99 90 bottom
SW2  44,23 270 top
TEENSY  51.99,92.88 270 bottom
U1  61.71,37.77 270 bottom
U2  60.31,75.01 90 bottom
U$2  17.82,47.19 270 bottom

### Tracks (layer width: path | path; a pad name or v marks a point on that pad's centre or on a via)
+3V3  (via drill 0.38)
  Top 0.254: STRIP1.9 72.75,6.75 71.5,8 71.5,15.25 KNOB1.1 71.5,15.5 71.5,25.75 76.75,31 76.75,31.5 STRIP2.9 76.75,31.75 75,33.5 75,43.75 75.5,44.25 | 75.5,44.25 76.75,45.5 STRIP3.9 | 75.5,44.25 75.5,49 76.5,50 76.5,59.25 76.75,59.5 STRIP4.9 | S4A8.1 97.25,83.25 98.5,82 98.5,77 97.25,75.75 S4A7.1 97.25,75.5 98.75,74 98.75,65.5 | 98.75,19.25 98.75,14.75 97.25,13.25 S1A2.1 | 98.75,19.25 97.25,20.75 S1A1.1 | 98.75,19.25 98.75,28 97.25,29.5 JOY2.1 97.25,29.75 98.75,31.25 98.75,41.5 97.25,43 S2A3.1 97.25,43.25 98.75,44.75 98.75,49.25 97.25,50.75 S2A4.1 97.25,51 98.75,52.5 98.75,61 | 98.75,61 97.25,59.5 S3A5.1 | 98.75,65.5 98.75,61 | 98.75,65.5 97.25,67 S3A6.1 | v29.5,76.5 29.5,87 32.25,87 32.5,86.75 35.25,86.75 TEENSY.3V3(3) | v45.75,34.5 45.75,45.75 TEENSY.3V3(2) | J4.9 14.75,6.75 13.25,8.25 13.25,13.5 11.5,15.25 KNOB3.1 11.5,15.5 11.5,30.25 13.75,32.5 STRIP6.9 13.75,32.75 12.5,34 12.5,37 14,38.5 14,67.5 STRIP5.9 | JOY1.1 2.75,46.5 3,46.75 3,53.25 S6A12.1 3.25,53.5 4.5,54.75 4.5,59.5 3,61 S6A11.1 2.75,61.25 1.25,62.75 1.25,66.5 2.75,68 2.75,70.75 S5A9.1 3,71 4.25,72.25 4.25,77.25 3,78.5 S5A10.1 | v40.5,7 40.25,7.25 40.25,32.75 40.5,33 TEENSY.3V3(4)
  Bottom 0.254: KNOB2.1 72.5,77.25 74,75.75 97,75.75 S4A7.1 | STRIP3.9 77,45.5 79.25,43.25 97,43.25 S2A3.1 | v29.5,76.5 28.75,75.75 13,75.75 11.5,77.25 KNOB4.1 11.25,77.5 10.25,78.5 3,78.5 S5A10.1 | v45.75,34.5 42,34.5 40.75,33.25 TEENSY.3V3(4) | TEENSY.3V3(1) 50.5,56 49.25,54.75 40,54.75 39.25,54 39.25,47.25 43.5,47.25 44.75,46 45.5,46 TEENSY.3V3(2) | STRIP5.9 14,67.75 5,67.75 4.5,68.25 4,68.25 3,69.25 3,70.75 S5A9.1 | J4.9 15,6.5 16.5,5 38.5,5 v40.5,7 72.5,7 72.75,6.75 STRIP1.9
+5V  (via drill 0.35, 0.38)
  Top 0.914: v53.47,79.63 54.6,80.77 64,80.77
  Top 1.27: J4.7 17.5,6.75 17.5,9.25 J4.8 17.5,10 v14.5,13 | v15.25,38.5 15.25,41.25 v16.75,42.75 16.5,43.25 15.25,44.5 v15.25,59.75 | v12,38.25 11.25,37.5 11.25,33.75 4.88,27.38 | 4.88,27.38 4,26.5 3,26.5 SERVO1.2 | SERVO2.2 3.25,18.75 5.25,18.75 5.25,27 4.88,27.38 | U1.3 65.5,36.5 63.75,38.25 63.75,47.25 64,47.5 64,80.77 64,85.75 61.5,88.25 J17.PWR 60.75,88.5 v57.75,91.5 | v22.5,98.75 22.5,81.75 25.25,79 J1.2 25.5,78.5 26.75,77.25 26.75,61.75 v25.75,60.75 | v39.25,98.75 44,94 R1.1
  Bottom 0.914: U2.9 55.34,79.63 v53.47,79.63
  Bottom 1.27: v16.75,42.75 22.5,42.75 U$2.9 | v15.25,38.5 15,38.25 v12,38.25 | v14.5,13 14,13.5 9.25,13.5 4.25,18.5 3.25,18.5 SERVO2.2 | v57.75,91.5 53.75,91.5 51.75,93.5 44.25,93.5 44,93.75 R1.1 | v39.25,98.75 v22.5,98.75 | v15.25,59.75 16.25,60.75 v25.75,60.75
+5V-BATTERY  (via drill 0.38)
  Top 1.27: v65,27.75 C1.1 | v60.5,39 61.5,38 v61.5,28.25
  Bottom 1.27: 61.5,27.75 44,27.75 SW2.1 | 61.5,27.75 v65,27.75 | v60.5,39 58,41.5 U1.8 | v61.5,28.25 61.5,27.75
+5V-BATTERY-PI  (via drill 0.38)
  Top 1.27: v86.25,73.25 86.25,88 86.5,88.25 J5.PWR
  Bottom 1.27: v86.25,73.25 82.25,73.25 80.75,71.75 RELAY1.5
AGND  (via drill 0.38)
  Top 0.406: v32,79.5 v32,86 | v19.25,76.75 19.25,73 16.75,70.5 STRIP5.8 | JOY1.2 2.75,43.75 1,45.5 1,54.25 S6A12.2 | v7,43.25 7,37.5 v7.5,37 7.25,37 v7.25,32.75 | S5A10.2 2.75,81 5.25,78.5 5.25,66.25 2.75,63.75 S6A11.2 | STRIP1.8 75.5,9.5 76.5,10.5 76.5,15.25 KNOB1.3 | S1A2.2 96.75,16 95.75,17 95.75,22.25 96.75,23.25 S1A1.2 96.75,23.5 95.5,24.75 95.5,33.75 95.62,33.88 | 95.62,33.88 96.75,32.75 96.75,32.25 JOY2.2 | 95.62,33.88 v95.25,34.25 95.25,44 96.75,45.5 S2A3.2 96.75,45.75 95.5,47 95.5,52 96.75,53.25 S2A4.2 96.75,53.5 95.5,54.75 95.5,63 95.62,63.12 | KNOB2.3 77.75,77.25 79.25,75.75 79.25,62.5 STRIP4.8 | 95.62,68.38 95.5,68.25 95.5,63.25 95.62,63.12 | 95.62,68.38 96.75,69.5 S3A6.2 | 95.62,63.12 96.75,62 S3A5.2 | 95.62,76.88 95.5,76.75 95.5,68.5 95.62,68.38 | 95.62,76.88 96.75,78 S4A7.2 | S4A8.2 96.75,85.75 95.5,84.5 95.5,77 95.62,76.88 | v12.5,27.75 16.5,23.75 16.5,15.5 KNOB3.3
  Bottom 0.406: v32,86 32.25,86 35.25,89 TEENSY.AGND | 30.38,77.88 30,77.5 19.25,77.5 | 30.38,77.88 v32,79.5 | 19.25,77.5 16.75,77.5 KNOB4.3 | 19.25,77.5 v19.25,76.75 | S5A10.2 2.5,81 1.25,81 1.25,74.75 2.5,73.5 S5A9.2 2.75,73.5 33,73.5 33,75.25 30.38,77.88 | v7.5,37 14.75,37 16.25,35.5 STRIP6.8 | v7,43.25 6.75,43.5 3,43.5 JOY1.2 | S6A11.2 2.5,63.5 2.5,62.75 1.5,61.75 1.5,56.25 2.75,56.25 S6A12.2 | KNOB3.3 16.75,15.25 67,15.25 68.25,14 75.25,14 76.5,15.25 KNOB1.3 76.75,15.5 96.5,15.5 96.75,15.75 S1A2.2 | v95.25,34.25 93,36.5 81.5,36.5 79.5,34.5 STRIP2.8 | STRIP3.8 79.5,48.5 83.25,52.25 95.75,52.25 96.75,53.25 S2A4.2 | KNOB2.3 77.75,77.5 78.25,78 96.75,78 S4A7.2 | v7.25,32.75 12.25,27.75 v12.5,27.75
AN1  (via drill 0.38)
  Top 0.406: v32.5,47 32.75,46.75 32.75,27 v32.5,26.75 | v55.25,21.25 55,21 55,18 68.5,4.5 83,4.5 83,6.5 STRIP1.1 83.25,6.75 84.75,8.25 84.75,13.5 v87.75,16.5
  Bottom 0.406: v32.5,47 34,47 35.25,48.25 TEENSY.39 | v32.5,26.75 38,21.25 v55.25,21.25 | v87.75,16.5 97,25.75 S1A1.3
AN2  (via drill 0.38)
  Top 0.406: v33.5,14.25 33.5,49 35.25,50.75 TEENSY.DAC0
  Bottom 0.406: v33.5,14.25 35.25,12.5 80,12.5 80.88,11.62 | 80.88,11.62 83,9.5 STRIP1.2 | S1A2.3 97.25,18.25 98.75,16.75 98.75,11.75 81,11.75 80.88,11.62
AN3  (via drill 0.38)
  Top 0.406: v36.75,40 36.75,52.25 35.5,53.5 TEENSY.DAC1 | v63,35.25 64.25,34 v64.25,30.5 | v93.25,44.25 93,44 v93,35
  Bottom 0.406: v36.75,40 39.75,37 54.25,37 56,35.25 v63,35.25 | v64.25,30.5 65.75,29 84.5,29 87,31.5 STRIP2.1 87.25,31.75 89.75,31.75 v93,35 | v93.25,44.25 97,48 S2A3.3
AN4  (via drill 0.38)
  Top 0.406: v46.25,63.75 46.25,78.25 46.75,78.75 46.75,93.75 51.75,98.75 98,98.75 98,97.75 98.75,97 98.75,92.25 v95.5,89 | v93.5,87 v93.5,59.5 92.25,58.25 92.25,36 v91.75,35.5
  Bottom 0.406: v46.25,63.75 35.5,63.75 TEENSY.15 | v93.5,87 v95.5,89 | v93.5,59.5 97,56 S2A4.3 | v91.75,35.5 88.25,35.5 87.25,34.5 STRIP2.2
AN5  (via drill 0.38)
  Top 0.406: v39.5,78.75 39.5,78.5 37.75,76.75 37.75,73.75 35.5,71.5 TEENSY.18 | v47.75,81 47.5,81.25 47.5,93.25 51.5,97.25 93.25,97.25 93.25,93 94.5,91.75 v94.5,67 94.5,52.5 v93.25,51.25
  Bottom 0.406: v39.5,78.75 41.75,81 v47.75,81 | v94.5,67 97,64.5 S3A5.3 | v93.25,51.25 92.75,51.25 87.25,45.75 STRIP3.1
AN6  (via drill 0.38)
  Top 0.406: v44.25,77.5 46,79.25 46,94.75 v49,97.75 | v81.75,96 86.5,91.25 88.75,91.25 88.75,90 92,86.75 v92,73.5 92,71.25 91.5,70.75 91.5,51.5 v91.25,51.25
  Bottom 0.406: v44.25,77.5 44,77.75 39.25,77.75 35.5,74 TEENSY.19 | v49,97.75 49.75,98.5 79.25,98.5 v81.75,96 | v92,73.5 93.25,72.25 97,72.25 S3A6.3 | v91.25,51.25 90,51.25 87.25,48.5 STRIP3.2
AN7  (via drill 0.38)
  Top 0.406: v48.5,89.75 49.25,90.5 49.25,93.75 50.5,95 54.25,95 v54.25,89.25 | v89.25,80.75 89.25,61.75 87.25,59.75 STRIP4.1
  Bottom 0.406: v48.5,89.75 45.75,89.75 43,87 36.75,87 36.75,77.75 35.5,76.5 TEENSY.20 | v54.25,89.25 61.75,81.75 84,81.75 85,80.75 v89.25,80.75 97,80.75 S4A7.3
AN8  (via drill 0.38)
  Top 0.406: v8.5,80.5 7,79 7,67 7.25,66.75 7.25,45 6,43.75 6,33.5 3,30.5 0.75,30.5 0.75,5.5 4,2.25 90.75,2.25 90.75,50.25 90.25,50.75 90.25,58.75 v89,60 | v84.75,82.5 85,82.25 85,64.5 87,62.5 STRIP4.2
  Bottom 0.406: v8.5,80.5 33.75,80.5 35.25,79 TEENSY.21 | v89,60 89,62.25 87.25,62.25 STRIP4.2 | v84.75,82.5 91.25,82.5 97,88.25 S4A8.3
AN9  (via drill 0.38)
  Top 0.406: v8,74.5 9,73.5 v9,66.25 | v38.75,25 38.75,39 40.5,40.75 TEENSY.49 | KNOB1.2 v74,21.25 | v28.25,66.75 28,66.5 28,61 25,58 25,49.25 24.75,49 24.75,37 26.5,35.25 v26.5,30.25
  Bottom 0.406: v8,74.5 4.5,74.5 3,76 S5A9.3 | v9,66.25 9.75,65.5 22.25,65.5 24.25,67.5 STRIP5.1 24.5,67.5 25.25,66.75 v28.25,66.75 | v74,21.25 68.75,26.5 54.5,26.5 52.5,24.5 50.5,24.5 50.25,24.75 39,24.75 v38.75,25 38.75,24.75 38.5,24.5 36.5,24.5 33.25,27.75 29,27.75 v26.5,30.25
AN10  (via drill 0.38)
  Top 0.406: v37.75,51.5 38.5,52.25 38.5,76.25 40.5,78.25 v40.5,91.75 40.5,93 42.5,93 43,92.5 44.5,92.5 45.25,93.25 45.25,95.5 v47.25,97.5 | v33.75,94.5 30,98.25 25,98.25 v25,97.25 | v77.75,74.5 75,77.25 KNOB2.2 | v21,97.5 21.25,97.25 21.25,73.5 24.25,70.5 STRIP5.2
  Bottom 0.406: v37.75,51.5 36.75,51.5 36.75,45.25 37.5,44.5 39.5,44.5 40.5,43.5 TEENSY.50 | v40.5,91.75 37.75,94.5 v33.75,94.5 | v25,97.25 24.75,97.5 v21,97.5 19,97.5 18,98.5 12.75,98.5 3,88.75 3,83.75 S5A10.3 | v77.75,74.5 96,74.5 96.5,74 97.75,74 98.75,75 98.75,93.25 93,93.25 87,99.25 49,99.25 v47.25,97.5
AN11  (via drill 0.38)
  Top 0.406: v21.75,19.5 24,21.75 24,32.5 STRIP6.1 | v6.5,81.5 6.25,81.25 v6.25,66.25 v6.25,57.5 | v29.25,40 30.75,41.5 30.75,46.25 v26.25,50.75
  Bottom 0.406: KNOB3.2 18,19.5 v21.75,19.5 | KNOB3.2 | v6.5,81.5 35.25,81.5 TEENSY.22 | v6.25,66.25 3,66.25 S6A11.3 | v29.25,40 29.5,40 30.25,39.25 30.25,36.75 29.5,36 27.5,36 24.25,32.75 STRIP6.1 | v26.25,50.75 24,53 24,57.25 21.5,57.25 21,57.75 10.75,57.75 10.5,57.5 v6.25,57.5
AN12  (via drill 0.38)
  Top 0.406: v24,58.25 24,35.5 STRIP6.2 | v9.25,79.5 9.25,75.75 10,75 v10,58.5
  Bottom 0.406: 9.25,79.25 12.25,79.25 KNOB4.2 | 9.25,79.25 5.5,79.25 5.5,82 6,82.5 7,82.5 7.25,82.25 33.75,82.25 35.25,83.75 TEENSY.23 | KNOB4.2 | v24,58.25 23.75,58.5 v10,58.5 3.25,58.5 S6A12.3 | v9.25,79.5 9.25,79.25
B1  (via drill 0.38)
  Top 0.254: v41.75,44.25 41.75,39.5 40.75,38.5 TEENSY.48 | v48,6 v48,43
  Bottom 0.254: v41.75,44.25 42,44.5 46.5,44.5 v48,43 | v48,6 49.75,4.25 78.25,4.25 80.5,6.5 STRIP1.3
B2  (via drill 0.38)
  Top 0.254: v42.75,65.5 42.75,58 41.75,57 41.75,49.5 40.75,48.5 TEENSY.51 | v52.5,67.5 58.75,67.5 v58.75,65.5 | v65.5,44.5 v65.5,58.75 | v89.5,39.25 90,38.75 90,20 80.75,10.75 80.75,9.5 STRIP1.4
  Bottom 0.254: v42.75,65.5 43.25,66 48.75,66 50.25,67.5 v52.5,67.5 | v65.5,58.75 v58.75,65.5 | v65.5,44.5 69.25,40.75 71.5,40.75 73.5,38.75 88.25,38.75 88.75,39.25 v89.5,39.25
B3  (via drill 0.38)
  Top 0.254: v89,38.25 88.5,37.75 88.5,33.75 87.75,33 84.75,33 84.75,31.75 STRIP2.3
  Bottom 0.254: v89,38.25 73.25,38.25 71.25,40.25 61,40.25 56.75,44.5 49.5,44.5 49.5,46.25 48.5,47.25 44.25,47.25 43.25,48.25 TEENSY.42
B4  (via drill 0.38)
  Top 0.254: v56.25,47.25 57.5,46 v57.5,45 | v80.75,39.75 84.5,36 84.5,34.5 STRIP2.4
  Bottom 0.254: v56.25,47.25 50.25,47.25 49.75,47.75 45.5,47.75 43.5,49.75 41.75,49.75 40.75,50.75 TEENSY.52 | v57.5,45 58,45.5 65.75,45.5 67.5,43.75 69.25,43.75 73.25,39.75 v80.75,39.75
B5  (via drill 0.38)
  Top 0.254: v49,53.75 49.25,54 v49.25,61.5 | v83.25,55.25 88.5,50 88.5,45 87.5,44 84.75,44 84.75,45.5 STRIP3.3
  Bottom 0.254: v49,53.75 43.25,53.75 TEENSY.40 | v49.25,61.5 50.25,62.5 60.5,62.5 69,54 71,54 72.25,55.25 v83.25,55.25
B6  (via drill 0.38)
  Top 0.254: v56.25,43.25 58.5,43.25 58.5,45.5 60.25,47.25 v60.25,50.25 | v83.25,53.25 84.5,52 84.5,48.5 STRIP3.4
  Bottom 0.254: v56.25,43.25 50.75,43.25 TEENSY.28 | v60.25,50.25 60.5,50.5 73.5,50.5 76.25,53.25 v83.25,53.25
B7  (via drill 0.38)
  Top 0.254: v66.5,46 66,46.5 66,51.75 v69.25,55
  Bottom 0.254: v66.5,46 50.75,46 TEENSY.27 | v69.25,55 70.5,56.25 81.5,56.25 81.75,56 82.25,56 84.5,58.25 84.5,59.5 STRIP4.3
B8  (via drill 0.38)
  Top 0.254: v74.25,50 74.25,73.75 71,77 71,80.5 76,85.5 77.75,85.5 77.75,79.25 84.25,72.75 84.25,62.75 84.5,62.5 STRIP4.4
  Bottom 0.254: v74.25,50 61.25,50 60,48.75 51,48.75 50.75,48.5 TEENSY.26
B9  (via drill 0.38)
  Top 0.254: v47.25,67 47.25,54.25 50.5,51 TEENSY.25 | v34.75,67.5 32,70.25 v32,74.75 | v15.5,74.75 12.5,71.75 12.5,70 13.5,69 21.5,69 21.5,67.75 STRIP5.3
  Bottom 0.254: v47.25,67 46.75,67.5 v34.75,67.5 | v15.5,74.75 v32,74.75
B10  (via drill 0.38)
  Top 0.254: v33.75,59.75 29.25,64.25 v29.25,69.75
  Bottom 0.254: v33.75,59.75 40.5,59.75 43,57.25 52,57.25 52,55 50.75,53.75 TEENSY.24 | v29.25,69.75 27,72 23.25,72 21.75,70.5 STRIP5.4
B11  (via drill 0.38)
  Top 0.254: v59.25,47.5 v55.75,51 | v69,44.75 68.5,44.25 68.5,25 67.25,23.75 67.25,16.5 v67.75,16 | v21.75,21 21.75,32.5 STRIP6.3
  Bottom 0.254: v55.75,51 55,51 55,55 52.25,57.75 51.5,57.75 50.75,58.5 TEENSY.12 | v59.25,47.5 59.75,47 66.75,47 v69,44.75 | v67.75,16 26.75,16 v21.75,21
B12  (via drill 0.38)
  Top 0.254: v67,51.5 68,50.5 68,25.25 66.75,24 v66.75,9 | v26.5,8 26.5,17.5 25,19 25,27.5 25.5,28 25.5,33.25 24.75,34 21.75,34 21.75,35.25 STRIP6.4
  Bottom 0.254: v67,51.5 67,55.25 62,60.25 51.5,60.25 50.75,61 TEENSY.11 | v66.75,9 65.75,8 v26.5,8
B13  (via drill 0.38)
  Top 0.254: v36.75,54.5 36.75,57.25 35.5,58.5 TEENSY.13
  Bottom 0.254: v36.75,54.5 36.75,52.25 33.25,52.25 32,51 27.75,51 26.5,52.25 S1.3
B14  (via drill 0.38)
  Top 0.254: v34.5,70 33.25,71.25 v33.25,83.25 | v14.75,83.25 10,78.5 10,76 12,74 12,66.5 13.5,65 13.5,41 v13,40.5 | v34.5,39.5 34.25,39.25 34.25,18.5 v34.5,18.25
  Bottom 0.254: v34.5,70 39.25,70 40.5,68.75 TEENSY.54 | v33.25,83.25 33,83 15,83 v14.75,83.25 | v13,40.5 13.25,40.75 18,40.75 18.5,41.25 21.25,41.25 21.75,40.75 23.5,40.75 24.25,41.5 29.75,41.5 31.75,39.5 v34.5,39.5 | v34.5,18.25 34.25,18 27.75,18 26.5,19.25 S2.3
B15  (via drill 0.38)
  Top 0.254: v43.75,62.75 43.75,66.25 41.75,68.25 41.75,72.75 40.75,73.75 TEENSY.56
  Bottom 0.254: v43.75,62.75 46.75,59.75 51.25,59.75 56,55 56,52.5 56.25,52.5 S3.3
B16  (via drill 0.38)
  Top 0.254: v52.5,63.5 52.5,20.75 v52,20.25
  Bottom 0.254: v52.5,63.5 56,67 57.25,67 57.25,81.75 57,82 55.25,82 50.75,86.5 TEENSY.1 | v52,20.25 52.75,19.5 56.25,19.5 S4.3
GND  (via drill 0.38)  (1 unrouted)
  Top 0.61: TEENSY.G1 43.25,46 45,47.75 v45,56 45,74 43,76 43,76.25 TEENSY.G6 43,76.5 43,77.5 42,78.5 42,82 v41.75,82.25 41.75,82.5 42,82.75 v42,92 | v67.25,79.5 67,79.75 67,86.75 61.25,92.5 61.25,94.5 J17.GND | STRIP5.10 14,70.5 14,71.75 18,75.75 18,76.75 18.25,77 18.25,78 16,80.25 16,96.75 J12.2 | v53.25,94 50.75,94 50.75,91.75 TEENSY.G0 | v47,33.25 47.25,33 47.25,18.75 v47,18.5 | v10,42.5 9.75,42.25 v9.75,35.75 | v29,12.5 S2.C | v65.75,11.5 65,12.25 C1.2 65,20.75 65.25,21 65.25,22.25 63.5,24 63.5,24.75 63.75,25 63.75,28.5 65.5,30.25 65.5,33.75 U1.4 | v88.25,64.75 88.25,71.5 RELAY1.2 88.25,71.75 88.25,78.75 v87.75,79.25 | v76,42 77,41 77,34.5 STRIP2.10 | v61.5,49 61.5,52.25 S3.1 | v75.5,50.25 75.5,58.75 75.25,59 75.25,60.75 76.75,62.25 STRIP4.10 | v51,9 R3.2
  Bottom 0.61: S1.C 29,52.5 31.25,52.5 S1.1 31.75,52.5 35.25,56 TEENSY.G2 35.75,56 v45,56 | v41.75,82.25 44,82.25 LED1.K | U2.11 65.25,80.5 65.25,79.5 U2.12 65.5,79.5 v67.25,79.5 67.5,79.5 67.75,79.75 82.75,79.75 83.25,79.25 v87.75,79.25 | J5.GND 86.5,94.75 61.5,94.75 J17.GND 61.25,94.75 57.25,94.75 56.5,94 v53.25,94 | 42.88,92.88 42.25,93.5 42.25,95.25 41.75,95.25 41.25,95.75 28.25,95.75 27.25,94.75 26.25,94.75 J3.GND 26,94.75 20.5,94.75 18.5,96.75 16.25,96.75 J12.2 | 42.88,92.88 44.25,91.5 50.5,91.5 TEENSY.G0 | 42.88,92.88 v42,92 | S2.C 29,19.5 31.5,19.5 S2.1 31.75,19.5 34.75,19.5 35.25,20 41,20 42.75,18.25 43.75,18.25 SW2.3 44,18.25 47,18.25 | 47,18.25 51,18.25 R3.2 | v47,33.25 43.25,33.25 TEENSY.G3 | v47,18.5 47,18.25 | v10,42.5 13,42.5 U$2.12 | STRIP6.10 13.75,35.5 10,35.5 v9.75,35.75 9.5,35.75 9,35.25 4.75,35.25 1,31.5 1,23.75 2.75,23.75 SERVO1.1 3,23.75 1,21.75 1,16.25 3.25,16.25 SERVO2.1 3.5,16.25 4.5,16.25 11.25,9.5 14.75,9.5 J4.10 15,9.5 15.25,9.5 17.75,12 28.5,12 v29,12.5 | C1.2 65,19.5 61.75,19.5 S4.1 61.25,19.5 59,19.5 S4.C | v65.75,11.5 66.12,11.12 | 66.12,11.12 67.75,9.5 72.75,9.5 STRIP1.10 | v88.25,64.75 79.5,64.75 77.25,62.5 77,62.5 STRIP4.10 | S3.C 59,52.5 61.5,52.5 S3.1 | U1.4 65.75,34 75.25,34 75.75,34.5 76.75,34.5 STRIP2.10 | 74.75,46.25 76.75,48.25 STRIP3.10 76.5,48.25 75.5,48.25 v75.5,50.25 | 74.75,46.25 74.75,42 v76,42 | v61.5,49 61.75,49.25 71.5,49.25 74.5,46.25 74.75,46.25 | v51,9 51.25,8.75 63.75,8.75 66.12,11.12
GNDBREAK
  Bottom 0.254: J3.GNDBREAK 31,91.25 32.5,92.75 38.25,92.75 40.25,90.75 49.25,90.75 49.75,90.25 59.5,90.25 60.5,91.25 J17.GNDBREAK J5.GNDBREAK
JOYB1
  Bottom 0.254: TEENSY.47 40.5,35.75 40,36.25 36.75,36.25 36,37 33.5,37 29.5,41 24.5,41 23.75,40.25 21,40.25 20.5,40.75 18.75,40.75 17.75,39.75 13.5,39.75 13.25,39.5 6,39.5 2.75,36.25 JOY1.5
JOYB2  (via drill 0.38)
  Top 0.254: v71.5,37.75 72.25,37 v72.25,27.75
  Bottom 0.254: v71.5,37.75 56.25,37.75 52,42 50.25,42 49.25,41 43.25,41 TEENSY.44 | v72.25,27.75 72.5,28 97.75,28 98.75,29 98.75,39.5 97.25,39.5 JOY2.5
JOYH1  (via drill 0.38)
  Top 0.406: v32.25,93.75 32.25,93.5 35.5,93.5 36.75,92.25 36.75,80.25 38,79 TEENSY.A11 | v9.25,92.25 1,84 v1,67.5
  Bottom 0.406: v32.25,93.75 28.75,93.75 27,92 15.5,92 15.25,92.25 v9.25,92.25 | v1,67.5 1,62.5 0.75,62.25 0.75,41.25 2.5,41.25 JOY1.3
JOYH2  (via drill 0.38)
  Top 0.406: v49.25,17 49.25,34.25 50.5,35.5 TEENSY.31 | v89,30.25 v75.75,17
  Bottom 0.406: v75.75,17 v49.25,17 | v89,30.25 89.75,31 93.5,31 97,34.5 JOY2.3
JOYV1  (via drill 0.38)
  Top 0.406: v24,96.5 24,99 31.25,99 39.5,90.75 39.5,82.75 38.25,81.5 TEENSY.A10 | v20.25,86.75 v20.25,96.5 | v30.5,85.25 31,84.75 v31,63.75 | v25,63.5 20.5,59 v20.5,56.75 | v10,44.75 v10,55.75
  Bottom 0.406: v20.25,96.5 v24,96.5 | v20.25,86.75 21.75,85.25 v30.5,85.25 | v31,63.75 30.75,63.5 v25,63.5 | v20.5,56.75 11,56.75 v10,55.75 | v10,44.75 4,38.75 3,38.75 JOY1.4
JOYV2
  Bottom 0.406: TEENSY.32 50.75,33 51,32.75 62.5,32.75 65,35.25 75.25,35.25 77.25,37.25 96.75,37.25 JOY2.4
LED1  (via drill 0.38)
  Top 0.254: v46,14.25 46,18.75 45,19.75 45,20.5 45.75,21.25 45.75,28.5 44.75,29.5 44.75,41.75 43.25,43.25 TEENSY.43 | v61,13.5 69.25,5.25 75.25,5.25 75.25,6.5 STRIP1.7
  Bottom 0.254: v46,14.25 46.75,13.5 v61,13.5
LED2  (via drill 0.38)
  Top 0.254: v55.75,49.75 55.25,49.25 55.25,38.75 56.25,37.75 60,37.75 v60,31.75
  Bottom 0.254: v55.75,49.75 44.25,49.75 43.25,50.75 TEENSY.41 | v60,31.75 60.25,31.5 71.5,31.5 73,33 78,33 79.25,31.75 STRIP2.7
LED3  (via drill 0.38)
  Top 0.254: v46.25,52.25 47,51.5 47,34.5 46,33.5 46,29 46.25,28.75 46.25,20.5 v46,20.25 | v83.75,41 79.5,45.25 79.5,45.5 STRIP3.7
  Bottom 0.254: v46.25,52.25 42,52.25 40.75,53.5 TEENSY.53 | v46,20.25 46.75,19.5 51.5,19.5 53,18 87.25,18 96.75,27.5 98,27.5 99.25,28.75 99.25,41 v83.75,41
LED4  (via drill 0.38)
  Top 0.254: v61.75,78 60.5,76.75 v60.5,67.25
  Bottom 0.254: v61.75,78 50.75,89 TEENSY.0 | v60.5,67.25 64,63.75 73.5,63.75 76.25,61 78,61 79.25,59.75 STRIP4.7
LED5  (via drill 0.38)
  Top 0.254: v4.25,67.25 v4.25,69.25
  Bottom 0.254: v4.25,69.25 7.75,72.75 18,72.75 18.25,72.5 39.5,72.5 40.5,71.5 TEENSY.55 | v4.25,67.25 12.5,67.25 13.5,66.25 15.25,66.25 16.5,67.5 STRIP5.7
LED6  (via drill 0.38)
  Top 0.254: v41.25,57.75 41.25,65.25 39.25,67.25 39.25,75 40.5,76.25 TEENSY.57 | v25.25,62.25 21.75,58.75 v21.75,55.5 | v5,34 v5,46.75
  Bottom 0.254: v41.25,57.75 40.75,57.25 33.75,57.25 28.75,62.25 v25.25,62.25 | v21.75,55.5 20.5,54.25 12.5,54.25 v5,46.75 | v5,34 15,34 16.25,32.75 STRIP6.7
M_INA  (via drill 0.38)
  Top 0.254: v39.75,34.5 41,34.5 41.75,35.25 41.75,37 43,38.25 TEENSY.45 | v37.75,29 v37.75,32.5 | v42.25,11 v42.25,28.75
  Bottom 0.254: v37.75,32.5 v39.75,34.5 | v37.75,29 38,28.75 v42.25,28.75 | v42.25,11 40.75,9.5 25.25,9.5 J4.2
M_INB  (via drill 0.38)
  Top 0.254: v41.25,11.5 41.25,29 41.75,29.5 41.75,34.25 43,35.5 TEENSY.46
  Bottom 0.254: v41.25,11.5 40.5,10.75 24,10.75 22.75,9.5 J4.4
M_PWMA  (via drill 0.38)
  Top 0.254: v31.75,40.75 32,40.5 32,28.5 v30.25,26.75 | v27.5,17 27.5,7.75 26.5,6.75 25.25,6.75 J4.1
  Bottom 0.254: v31.75,40.75 35.25,40.75 TEENSY.36 | v30.25,26.75 29.5,26 26,26 25,25 25,18.5 25.5,18.5 27,17 v27.5,17
M_PWMB
  Top 0.254: TEENSY.35 35.5,38.25 36.75,37 36.75,27.25 35.5,26 35.5,13.25 27.5,5.25 22.75,5.25 22.75,6.5 J4.3
N$2
  Top 0.254: LED1.A 44,79.75 42.75,81 42.75,84.75 44,86 R1.2
N$3  (via drill 0.38)
  Top 0.254: v55,25.5 56,26.5 56,32 57.75,33.75 U1.5
  Bottom 0.254: v55,25.5 52.5,23 SW2.2
N$4  (via drill 0.38)
  Top 0.254: v69.25,51.5 69,51.25 v69,48 | v62.5,48 59,44.5 59,40.25 58,39.25 U1.7
  Bottom 0.254: v69.25,51.5 72,54.25 88.75,54.25 91,56.5 91.25,56.5 91.25,67 91,67.25 91,71.5 RELAY1.1 | v62.5,48 v69,48
N$5  (via drill 0.38)
  Top 0.254: v14.75,91.25 14.75,95.25 13.25,96.75 J12.1 | v26,84.25 v24,86.25 | v43.25,88.75 45,88.75 v45,87.5 | v48.5,86 49.5,85 49.5,63.25 50.25,62.5 52,62.5 52,27 51,26 R3.1
  Bottom 0.254: R2.2 37,26 51,26 R3.1 | v14.75,91.25 18.25,87.75 22.5,87.75 v24,86.25 | v26,84.25 31.5,84.25 35,87.75 42.25,87.75 v43.25,88.75 | v45,87.5 46.5,86 v48.5,86
N$6  (via drill 0.38)
  Top 1.27: v67.75,71.5 65.75,73.5 v65.75,83 | v60,85.25 55.75,89.5 v55.75,95.25 | v29.5,97 29,96.5 29,93.5 26.25,90.75 26.25,88.5 J3.PWR
  Bottom 1.27: v67.75,71.5 73,71.5 RELAY1.8 | v65.75,83 63.5,85.25 v60,85.25 | v55.75,95.25 55,96 43.5,96 42.5,97 v29.5,97
N$7
  Top 0.254: TEENSY.VIN 35.25,91.5 32,88.25 28.75,88.25 28.75,79.5 28.25,79 J1.1
PI-REST
  Top 0.254: U1.6 57.5,36.5 55.5,34.5 55.5,31 54,29.5 54,25.25 54.25,25 54.25,3.25 43,3.25 39.5,6.75 39.5,15.5 37,18 R2.1
PWM1  (via drill 0.38)
  Top 0.254: v52.4,78.5 52,80.5 52,82.5 50.75,83.75 TEENSY.2
  Bottom 0.254: v52.4,78.5 55.25,78.5 55.5,78.25 U2.8
PWM2
  Bottom 0.254: U2.7 55.5,77 55,77.5 51.25,77.5 51,77.75 50.25,77.75 49.5,78.5 49.5,81.25 50.5,81.25 TEENSY.3
PWM3
  Bottom 0.254: U2.6 55.75,75.75 56,76 56.25,76 56.75,76.5 56.75,81.5 53.25,81.5 50.75,79 TEENSY.4
PWM4
  Bottom 0.254: U2.5 55.5,74.5 55.25,74.75 52.25,74.75 50.75,76.25 TEENSY.5
PWM5
  Bottom 0.254: U2.4 55.5,73.25 55.25,73.5 51,73.5 50.75,73.75 TEENSY.6
PWM6
  Bottom 0.254: U2.3 55.5,71.75 55.25,71.5 50.75,71.5 TEENSY.7
PWM7
  Bottom 0.254: U2.2 55.5,70.5 55,70 52,70 50.75,68.75 TEENSY.8
PWM8
  Bottom 0.254: U2.1 55.5,69.25 52.5,66.25 50.75,66.25 TEENSY.9
PWM9
  Bottom 0.254: U$2.8 22.75,44 34.75,44 35.25,43.5 TEENSY.37
PWM10  (via drill 0.38)
  Top 0.254: v38.75,40.75 v38.75,43
  Bottom 0.254: v38.75,43 38,43 36.25,44.75 23.25,44.75 22.75,45.25 U$2.7 | v38.75,40.75 40,39.5 49.25,39.5 50.5,40.75 TEENSY.29
PWM11
  Bottom 0.254: U$2.6 22.75,46.5 23.25,46 35.25,46 TEENSY.38
PWM12  (via drill 0.38)
  Top 0.254: v21,48.25 18.75,50.5 18.75,52.5 18,53.25 v18,62.25 | v25.25,65.75 v23.25,63.75 | v32,65.75 34.25,63.5 34.25,62.25 35.25,61.25 TEENSY.14
  Bottom 0.254: v21,48.25 22.25,48.25 22.5,48 U$2.5 | v18,62.25 19.5,63.75 v23.25,63.75 | v32,65.75 v25.25,65.75
PWM13  (via drill 0.38)
  Top 0.254: v25.75,47 28.5,44.25 v28.5,43 | v49,42 49.5,41.5 49.5,39.5 50.5,38.5 TEENSY.30
  Bottom 0.254: v25.75,47 24,48.75 23,48.75 22.75,49 U$2.4 | v28.5,43 29.5,42 v49,42
PWM14  (via drill 0.38)
  Top 0.254: v25.75,48.5 29.75,44.5 v29.75,43 | v31.75,43 31.5,43.25 31.5,47.75 32.75,49 32.75,49.5 34.25,51 34.25,59 35,59.75 36.75,59.75 36.75,64.75 35.5,66 TEENSY.16
  Bottom 0.254: v25.75,48.5 24.25,50 23,50 22.75,50.25 U$2.3 | v31.75,43 v29.75,43
PWM15  (via drill 0.38)
  Top 0.254: v21,51.75 20.5,52.25 v20.5,55.5 | v11.5,63.75 v11.5,55.75
  Bottom 0.254: v21,51.75 22.5,51.75 U$2.2 | v20.5,55.5 20.25,55.75 v11.5,55.75 | v11.5,63.75 12.5,64.75 34.75,64.75 35,65 39,65 39.5,64.5 45.75,64.5 46,64.75 49.5,64.75 50.5,63.75 TEENSY.10
PWM16  (via drill 0.38)
  Top 0.254: v17.75,52 16.5,53.25 v16.5,62.25 | v9,62.75 8,63.75 v8,68.75
  Bottom 0.254: v17.75,52 19.25,52 20,52.75 22.5,52.75 U$2.1 | v16.5,62.25 16,62.75 v9,62.75 | v8,68.75 8.25,69 29,69 29.25,68.75 35.25,68.75 TEENSY.17
PWM_1  (via drill 0.38)
  Top 0.61: v55.25,63.5 53.25,61.5 v53.25,6
  Bottom 0.61: v55.25,63.5 60.25,68.5 64.25,68.5 65,69.25 U2.20 | v53.25,6 54.25,5 76.5,5 78,6.5 STRIP1.5
PWM_2  (via drill 0.38)
  Top 0.61: v67.75,68.75 67.75,58 70.5,55.25 70.5,43.25 70.25,43 v70.25,28 | v79.25,19 78.25,18 78.25,9.75 78,9.5 STRIP1.6
  Bottom 0.61: v67.75,68.75 66.25,70.25 65.5,70.25 65.25,70.5 U2.19 | v79.25,19 v70.25,28
PWM_3  (via drill 0.38)
  Top 0.61: v62.5,64 v62.5,71.5 | v72.75,57.25 73,57 73,33.25 v75.25,31
  Bottom 0.61: v62.5,71.5 64.75,71.5 65,71.75 U2.18 | v62.5,64 69.25,57.25 v72.75,57.25 | v75.25,31 76.25,30 80.5,30 82,31.5 STRIP2.5
PWM_4  (via drill 0.38)
  Top 0.61: v71.5,73 71.25,72.75 71.25,63.25 71.5,63 v71.5,42.75 | v78.25,40.75 82,37 STRIP2.6
  Bottom 0.61: v71.5,73 65.25,73 U2.17 | v71.5,42.75 73.5,40.75 v78.25,40.75
PWM_5  (via drill 0.38)
  Top 0.61: v88.5,55.25 89.25,54.5 89.25,44.5 88,43.25 82.75,43.25 82.75,44.75 82,45.5 STRIP3.5
  Bottom 0.61: v88.5,55.25 90.25,57 90.25,64.25 88.5,66 84.25,66 75.75,74.5 65.25,74.5 U2.16
PWM_6  (via drill 0.38)
  Top 0.61: v67.25,75.75 69,74 v69,62.5 | STRIP3.6 v82,57
  Bottom 0.61: v67.25,75.75 65.25,75.75 U2.15 | v69,62.5 74.5,57 v82,57
PWM_7  (via drill 0.38)
  Top 0.61: v67.5,77 70.25,74.25 v70.25,62.75
  Bottom 0.61: v67.5,77 65.25,77 U2.14 | v70.25,62.75 75,58 80.5,58 82,59.5 STRIP4.5
PWM_8  (via drill 0.38)
  Top 0.61: v73.25,73.25 v68.25,78.25 | v80.5,66 82,64.5 STRIP4.6
  Bottom 0.61: v68.25,78.25 65.25,78.25 U2.13 | v80.5,66 v73.25,73.25
PWM_9  (via drill 0.38)
  Top 0.61: v19.25,53.25 19.25,67.5 STRIP5.5
  Bottom 0.61: v19.25,53.25 13.5,53.25 13.25,53 U$2.20
PWM_10  (via drill 0.38)
  Top 0.61: v11.5,51.75 12.75,53 12.75,64.5 11,66.25 v11,70
  Bottom 0.61: v11.5,51.75 13,51.75 U$2.19 | v11,70 13,72 17.5,72 19,70.5 STRIP5.6
PWM_11  (via drill 0.38)
  Top 0.61: v8.75,46.75 8.75,36.25 8.5,36 v8.5,33
  Bottom 0.61: v8.75,46.75 12.25,50.25 13,50.25 U$2.18 | v8.5,33 10.5,31 17.5,31 19,32.5 STRIP6.5
PWM_12  (via drill 0.38)
  Top 0.61: v16.75,49 19,46.75 STRIP6.6
  Bottom 0.61: v16.75,49 13.25,49 U$2.17
PWM_13  (via drill 0.38)
  Top 0.61: v21,50.25 23,52.25 23,57.75 22.75,58 22.75,58.5 23.75,59.5 24.75,59.5 v24.75,59.25
  Bottom 0.61: v21,50.25 18.5,47.75 13.25,47.75 U$2.16 | v24.75,59.25 25,59 27.75,59 29,57.75 S1.A
PWM_14  (via drill 0.38)
  Top 0.61: v20.25,46.5 23,43.75 v23,37.25 | S2.A v29,37
  Bottom 0.61: v20.25,46.5 13.25,46.5 U$2.15 | v23,37.25 23.25,37 v29,37
PWM_15  (via drill 0.38)
  Top 0.61: v16.75,45.25 18,44 18,39 v17.75,38.75 | v29.25,38.75 30.25,37.75 v30.25,31.25 | v54.5,31.25 54.5,57.75 55.75,59 59,59 S3.A
  Bottom 0.61: v16.75,45.25 13.25,45.25 U$2.14 | v17.75,38.75 18,38.5 28.5,38.5 28.75,38.75 v29.25,38.75 | v54.5,31.25 v30.25,31.25
PWM_16  (via drill 0.38)
  Top 0.61: v20.25,39.75 v20.25,44.25 | v25.75,39.75 27.75,37.75 27.75,35.25 28,35 28,30.75 v27.75,30.5 | v57,29.25 59,27.25 S4.A
  Bottom 0.61: v20.25,44.25 20,44 13.25,44 U$2.13 | v20.25,39.75 20.5,39.5 25.5,39.5 v25.75,39.75 | v27.75,30.5 28.25,30 37.25,30 37.5,30.25 54,30.25 55,29.25 v57,29.25
S1
  Top 0.254: J4.5 20,6.5 18.5,5 7.75,5 7.75,9.5 1.5,15.75 1.5,27.25 3,28.75 SERVO1.3
  Bottom 0.254: TEENSY.33 35.25,33 35,32.75 26.25,32.75 20.25,26.75 5.25,26.75 3.25,28.75 SERVO1.3
S2  (via drill 0.38)
  Top 0.254: v20.75,24.5 20.75,10.25 20,9.5 J4.6
  Bottom 0.254: 19.75,25.5 19.25,25 7.25,25 3.5,21.25 SERVO2.3 | 19.75,25.5 26.5,32.25 30.5,32.25 30.75,32 36.75,32 36.75,34.25 35.5,35.5 TEENSY.34 | 19.75,25.5 v20.75,24.5

### Text on the board
tPlace: MO Teensy Breakout | 2017 Ali Momeni, Desgined in Pittsburgh | v2-3b | v2-3b
bPlace: MO Teensy Breakout | 2017 Ali Momeni, Desgined in Pittsburgh